# Altium project A3000_16MB.PrjPcb (part 1 of 2)
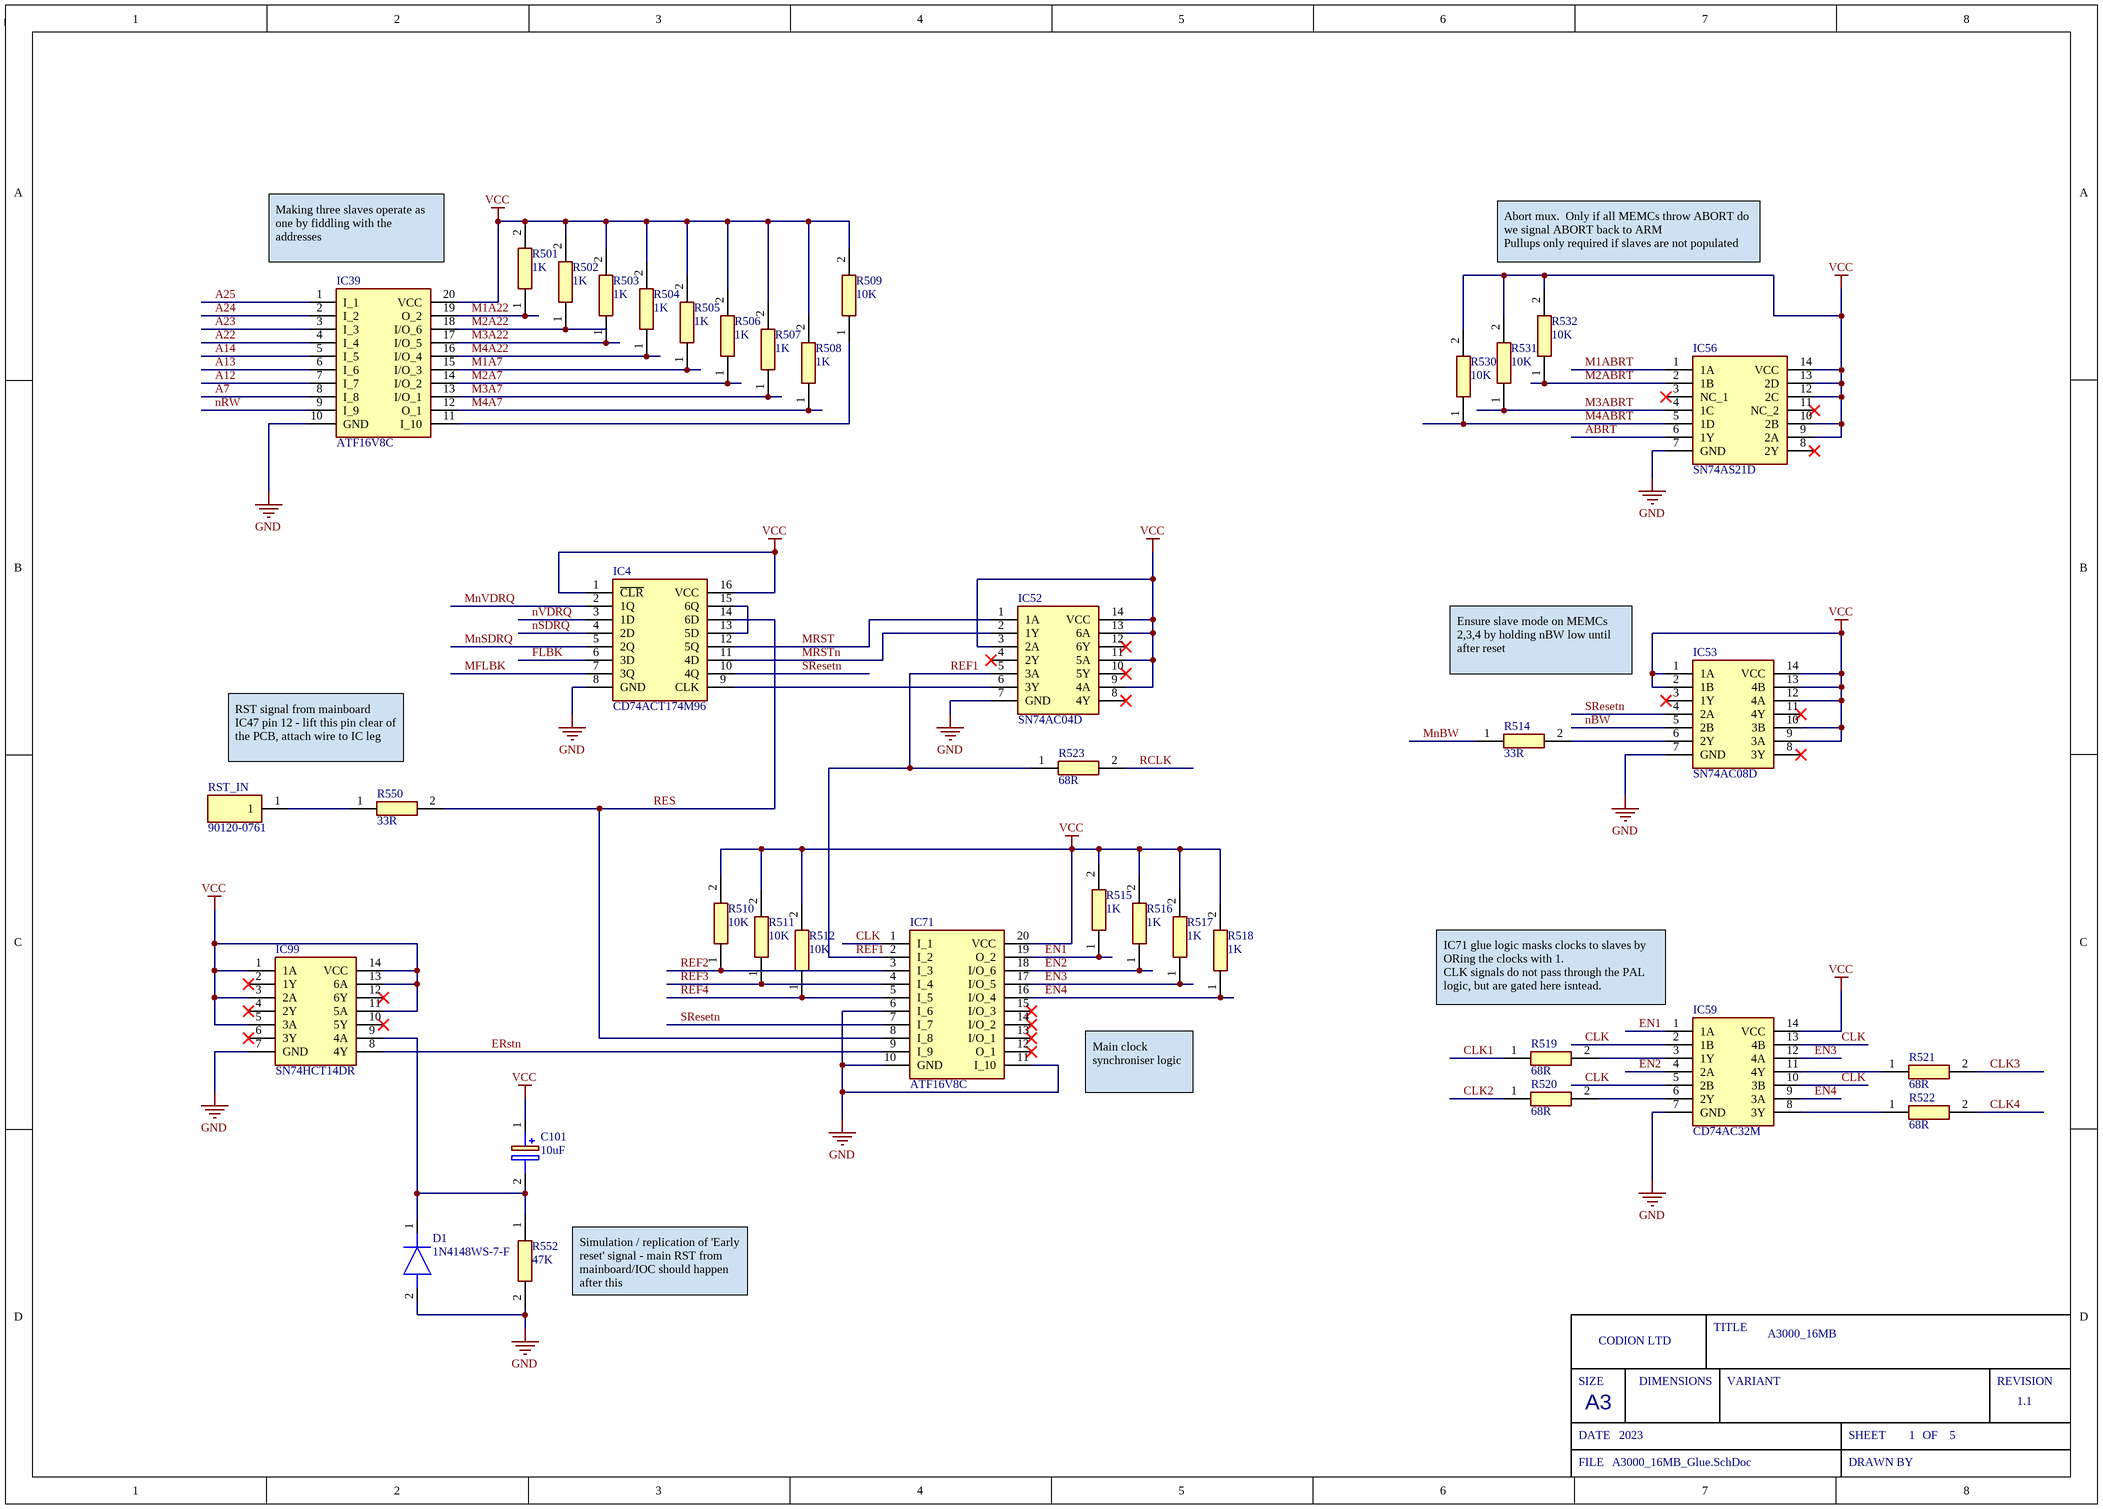
[diagram p0: A3000_16MB_Glue.SchDoc]
BOM_RevNo: 1.1; Engineer_Name: Codion Ltd; PCB_RevNo: 1.1; Project_Title: A3000_16MB; ProjectName: A3000_16MB; Sch_releaseDate: 2023; Sch_RevNo: 1.1
5 sheets, 135 parts. Net scope: global (net labels, ports and power ports of the same name join across sheets).
Board file: A3000_16MB.pcbdoc
Sheets:
  A3000_16MB_Glue.SchDoc
  A3000_16MB.SchDoc
  A3000_16MB_M2.SchDoc
  A3000_16MB_M3.SchDoc
  A3000_16MB_M4.SchDoc

## Sheet A3000_16MB_Glue.SchDoc
size A3; DocumentNumber: 1; SheetNumber: 1; SheetTotal: 5

### Parts
C101  10uF  [EEE0GA101SR]
D1  1N4148WS-7-F  [SOD2513X120N]
IC4  CD74ACT174M96  [SOIC127P600X175-16N]
IC39  ATF16V8C  [DIP762W66P254L2692H508Q20N]
IC52  SN74AC04D  [SOIC127P600X175-14N]
IC53  SN74AC08D  [SOIC127P600X175-14N]
IC56  SN74AS21D  [SOIC127P600X175-14N]
IC59  CD74AC32M  [SOIC127P600X175-14N]
IC71  ATF16V8C  [DIP762W66P254L2692H508Q20N]
IC99  SN74HCT14DR  [SOIC127P600X175-14N]
R501  1K  [RESC1005X40N]
R502  1K  [RESC1005X40N]
R503  1K  [RESC1005X40N]
R504  1K  [RESC1005X40N]
R505  1K  [RESC1005X40N]
R506  1K  [RESC1005X40N]
R507  1K  [RESC1005X40N]
R508  1K  [RESC1005X40N]
R509  10K  [RESC1005X40N]
R510  10K  [RESC1005X40N]
R511  10K  [RESC1005X40N]
R512  10K  [RESC1005X40N]
R514  33R  [RESC1005X40N]
R515  1K  [RESC1005X40N]
R516  1K  [RESC1005X40N]
R517  1K  [RESC1005X40N]
R518  1K  [RESC1005X40N]
R519  68R  [RESC1005X40N]
R520  68R  [RESC1005X40N]
R521  68R  [RESC1005X40N]
R522  68R  [RESC1005X40N]
R523  68R  [RESC1005X40N]
R530  10K  [RESC1005X40N]
R531  10K  [RESC1005X40N]
R532  10K  [RESC1005X40N]
R550  33R  [RESC1005X40N]
R552  47K  [RESC1005X40N]
RST_IN  90120-0761  [HDRV1W90P0X254_1X1_232X249X560P]

### Nets
GND: D1.2(A) IC4.8(GND) IC39.10(GND) IC52.7(GND) IC53.7(GND) IC56.7(GND) IC59.7(GND) IC71.6(I_6) IC71.10(GND) IC71.11(I_10) IC99.7(GND) R552.2
VCC: C101.1(+) IC4.1(~{CLR}) IC4.16(VCC) IC39.20(VCC) IC52.3(2A) IC52.9(4A) IC52.11(5A) IC52.13(6A) IC52.14(VCC) IC53.1(1A) IC53.2(1B) IC53.9(3A) IC53.10(3B) IC53.12(4A) IC53.13(4B) IC53.14(VCC) IC56.9(2A) IC56.10(2B) IC56.12(2C) IC56.13(2D) IC56.14(VCC) IC59.14(VCC) IC71.20(VCC) IC99.1(1A) IC99.3(2A) IC99.5(3A) IC99.11(5A) IC99.13(6A) IC99.14(VCC) R501.2 R502.2 R503.2 R504.2 R505.2 R506.2 R507.2 R508.2 R509.2 R510.2 R511.2 R512.2 R515.2 R516.2 R517.2 R518.2 R530.2 R531.2 R532.2
A7: IC39.8(I_8)
A12: IC39.7(I_7)
A13: IC39.6(I_6)
A14: IC39.5(I_5)
A22: IC39.4(I_4)
A23: IC39.3(I_3)
A24: IC39.2(I_2)
A25: IC39.1(I_1)
ABRT: IC56.6(1Y)
CLK: IC59.2(1B) IC59.5(2B) IC59.10(3B) IC59.13(4B) IC71.1(I_1)
CLK1: R519.1
CLK2: R520.1
CLK3: R521.2
CLK4: R522.2
EN1: IC59.1(1A) IC71.19(O_2) R515.1
EN2: IC59.4(2A) IC71.18(I/O_6) R516.1
EN3: IC59.12(4A) IC71.17(I/O_5) R517.1
EN4: IC59.9(3A) IC71.16(I/O_4) R518.1
ERstn: IC71.9(I_9) IC99.8(4Y)
FLBK: IC4.6(3D)
M1A7: IC39.15(I/O_3) R505.1
M1A22: IC39.19(O_2) R501.1
M1ABRT: IC56.1(1A)
M2A7: IC39.14(I/O_2) R506.1
M2A22: IC39.18(I/O_6) R502.1
M2ABRT: IC56.2(1B) R532.1
M3A7: IC39.13(I/O_1) R507.1
M3A22: IC39.17(I/O_5) R503.1
M3ABRT: IC56.4(1C) R531.1
M4A7: IC39.12(O_1) R508.1
M4A22: IC39.16(I/O_4) R504.1
M4ABRT: IC56.5(1D) R530.1
MFLBK: IC4.7(3Q)
MnBW: R514.1
MnSDRQ: IC4.5(2Q)
MnVDRQ: IC4.2(1Q)
MRST: IC4.12(5Q) IC52.1(1A)
MRSTn: IC4.11(4D) IC52.2(1Y)
nBW: IC53.5(2B)
nRW: IC39.9(I_9)
nSDRQ: IC4.4(2D)
nVDRQ: IC4.3(1D)
RCLK: R523.2
REF1: IC52.5(3A) IC71.2(I_2) R523.1
REF2: IC71.3(I_3) R510.1
REF3: IC71.4(I_4) R511.1
REF4: IC71.5(I_5) R512.1
RES: IC4.14(6D) IC71.8(I_8) R550.2
SResetn: IC4.10(4Q) IC53.4(2A) IC71.7(I_7)
NetC101_2: C101.2(-) D1.1(K) IC99.9(4A) R552.1
NetIC4_9: IC4.9(CLK) IC52.6(3Y)
NetIC4_13: IC4.13(5D) IC4.15(6Q)
NetIC39_11: IC39.11(I_10) R509.1
NetIC53_6: IC53.6(2Y) R514.2
NetIC59_3: IC59.3(1Y) R519.2
NetIC59_6: IC59.6(2Y) R520.2
NetIC59_8: IC59.8(3Y) R522.1
NetIC59_11: IC59.11(4Y) R521.1
NetR550_1: R550.1 RST_IN.1

Not connected (* = marked no-connect by the designer): IC52 4(2Y)* 8(4Y)* 10(5Y)* 12(6Y)*; IC53 3(1Y)* 8(3Y)* 11(4Y)*; IC56 3(NC_1)* 8(2Y)* 11(NC_2)*; IC71 12(O_1)* 13(I/O_1)* 14(I/O_2)* 15(I/O_3)*; IC99 2(1Y)* 4(2Y)* 6(3Y)* 10(5Y)* 12(6Y)*

### Notes on the sheet
- (near IC39) Making three slaves operate as one by fiddling with the addresses
- Abort mux.  Only if all MEMCs throw ABORT do we signal ABORT back to ARM
  Pullups only required if slaves are not populated
- Ensure slave mode on MEMCs 2,3,4 by holding nBW low until after reset
- RST signal from mainboard IC47 pin 12 - lift this pin clear of the PCB, attach wire to IC leg
- IC71 glue logic masks clocks to slaves by ORing the clocks with 1.
  CLK signals do not pass through the PAL logic, but are gated here isntead.
- Main clock synchroniser logic
- Simulation / replication of 'Early reset' signal - main RST from mainboard/IOC should happen after this
- SIZE
- CODION LTD
- DIMENSIONS
- TITLE
- VARIANT
- REVISION
- DATE
- A3
- SHEET
- OF
- FILE
- DRAWN BY

### Library data of the parts
C101 = EEE-1EA100SR: Capacitor Polarised; Manufacturer_Name: Panasonic; Datasheet Link: http://industrial.panasonic.com/cdbs/www-data/pdf/RDE0000/ABA0000C1145.pdf; Height: 6.5mm; Manufacturer_Part_Number: EEE-1EA100SR; Mouser Part Number: 667-EEE-1EA100SR; Mouser Price/Stock: https://www.mouser.co.uk/ProductDetail/Panasonic/EEE-1EA100SR?qs=ANJC8C65Mw4%2Fvo1GoepKcQ%3D%3D; Arrow Part Number: EEE-1EA100SR; Arrow Price/Stock: https://www.arrow.com/en/products/eee-1ea100sr/panasonic?region=nac
D1 = 1N4148WS-7-F: Diode; Manufacturer_Name: Diodes Inc.; Datasheet Link: https://componentsearchengine.com/Datasheets/2/1N4148WS-7-F.pdf; Height: 1.2mm; Manufacturer_Part_Number: 1N4148WS-7-F; Mouser Part Number: 621-1N4148WS-F; Mouser Price/Stock: https://www.mouser.co.uk/ProductDetail/Diodes-Incorporated/1N4148WS-7-F?qs=4drIV0IxA0r8aNy7%2Fu4kVw%3D%3D; Arrow Part Number: 1N4148WS-7-F; Arrow Price/Stock: https://www.arrow.com/en/products/1n4148ws-7-f/diodes-incorporated?region=asia; LCSC Part #: C2128
IC4 = CD74ACT174M96: Integrated Circuit; Manufacturer_Name: Texas Instruments; Datasheet Link: http://www.ti.com/lit/gpn/cd74act174; Height: 1.75mm; Manufacturer_Part_Number: CD74ACT174M96; Mouser Part Number: 595-CD74ACT174M96; Mouser Price/Stock: https://www.mouser.co.uk/ProductDetail/Texas-Instruments/CD74ACT174M96?qs=w32V8uFkMxkDXs1ka6HDkg%3D%3D
IC39 IC71 = PAL16R4AMJ: Integrated Circuit; Manufacturer_Name: Texas Instruments; Datasheet Link: http://www.ti.com/lit/ds/symlink/pal16r4am.pdf; Height: 5.08mm; Manufacturer_Part_Number: PAL16R4AMJ; Mouser Part Number: 595-PAL16R4AMJ; Mouser Price/Stock: https://www.mouser.com/Search/Refine.aspx?Keyword=595-PAL16R4AMJ
IC52 = SN74AC04D: Integrated Circuit; Manufacturer_Name: Texas Instruments; Datasheet Link: http://www.ti.com/lit/ds/symlink/sn74ac04.pdf; Height: 1.75mm; Manufacturer_Part_Number: SN74AC04D; Mouser Part Number: 595-SN74AC04D; Mouser Price/Stock: https://www.mouser.co.uk/ProductDetail/Texas-Instruments/SN74AC04D?qs=w32V8uFkMxkvsyMHHacuZw%3D%3D; Arrow Part Number: SN74AC04D; Arrow Price/Stock: https://www.arrow.com/en/products/sn74ac04d/texas-instruments?region=nac; LCSC Part #: C352940
IC53 = SN74AC08D: Integrated Circuit; Manufacturer_Name: Texas Instruments; Datasheet Link: http://www.ti.com/lit/gpn/sn74ac08; Height: 1.75mm; Manufacturer_Part_Number: SN74AC08D; Mouser Part Number: 595-SN74AC08D; Mouser Price/Stock: https://www.mouser.co.uk/ProductDetail/Texas-Instruments/SN74AC08D?qs=w32V8uFkMxlOh0tslhqkwg%3D%3D; Arrow Part Number: SN74AC08D; Arrow Price/Stock: https://www.arrow.com/en/products/sn74ac08d/texas-instruments; LCSC Part #: C352941
IC56 = SN74AS21D: Integrated Circuit; Manufacturer_Name: Texas Instruments; Datasheet Link: https://www.ti.com/lit/ds/symlink/sn74as21.pdf?HQS=dis-mous-null-mousermode-dsf-pf-null-wwe&ts=1632126162167&ref_url=https%253A%252F%252Fwww.mouser.in%252F; Height: 1.75mm; Manufacturer_Part_Number: SN74AS21D; Mouser Part Number: 595-SN74AS21D; Mouser Price/Stock: https://www.mouser.com/Search/Refine.aspx?Keyword=595-SN74AS21D; Arrow Part Number: SN74AS21D; Arrow Price/Stock: https://www.arrow.com/en/products/sn74as21d/texas-instruments
IC59 = CD74AC32M: Integrated Circuit; Manufacturer_Name: Texas Instruments; Datasheet Link: http://www.ti.com/lit/ds/symlink/cd74ac32.pdf; Height: 1.75mm; Manufacturer_Part_Number: CD74AC32M; Mouser Part Number: 595-CD74AC32M; Mouser Price/Stock: https://www.mouser.co.uk/ProductDetail/Texas-Instruments/CD74AC32M?qs=OorDGPQ79Eqsy7tzrsTtUg%3D%3D; Arrow Part Number: CD74AC32M; Arrow Price/Stock: https://www.arrow.com/en/products/cd74ac32m/texas-instruments; LCSC Part #: C352943
IC99 = SN74HCT14DR: Integrated Circuit; Manufacturer_Name: Texas Instruments; Datasheet Link: http://www.ti.com/lit/ds/symlink/sn74hct14.pdf; Height: 1.75mm; Manufacturer_Part_Number: SN74HCT14DR; Mouser Part Number: 595-SN74HCT14DR; Mouser Price/Stock: https://www.mouser.co.uk/ProductDetail/Texas-Instruments/SN74HCT14DR?qs=SL3LIuy2dWxogEVGE105Iw%3D%3D; Arrow Part Number: SN74HCT14DR; Arrow Price/Stock: https://www.arrow.com/en/products/sn74hct14dr/texas-instruments?region=nac; LCSC Part #: C6769
R501-R508 R515-R518 = CRCW04021K00JNED: Resistor; Manufacturer_Name: Vishay; Datasheet Link: http://www.vishay.com/docs/20035/dcrcwe3.pdf; Height: 0.4mm; Manufacturer_Part_Number: CRCW04021K00JNED; Mouser Part Number: 71-CRCW0402J-1.0K-E3; Mouser Price/Stock: https://www.mouser.co.uk/ProductDetail/Vishay-Dale/CRCW04021K00JNED?qs=YX%252BK5oaHNYpGRsHVuzxl1A%3D%3D; Arrow Part Number: CRCW04021K00JNED; Arrow Price/Stock: https://www.arrow.com/en/products/crcw04021k00jned/vishay; LCSC Part #: C279981
R509-R512 R530-R532 = CRCW040210K0FKEDHP: Resistor; Manufacturer_Name: Vishay; Datasheet Link: http://www.vishay.com/docs/20035/dcrcwe3.pdf; Height: 0.4mm; Manufacturer_Part_Number: CRCW040210K0FKEDHP; Mouser Part Number: 71-CRCW040210K0FKEDH; Mouser Price/Stock: https://www.mouser.co.uk/ProductDetail/Vishay-Dale/CRCW040210K0FKEDHP?qs=FlFvgi4rxBxmIiaeyFjrkA%3D%3D; Arrow Part Number: CRCW040210K0FKEDHP; Arrow Price/Stock: https://www.arrow.com/en/products/crcw040210k0fkedhp/vishay?region=nac; LCSC Part #: C71617
R514 R550 = CRCW040233R0FKED: Resistor; Manufacturer_Name: Vishay; Datasheet Link: http://www.vishay.com/docs/20035/dcrcwe3.pdf; Height: 0.4mm; Manufacturer_Part_Number: CRCW040233R0FKED; Mouser Part Number: 71-CRCW0402-33-E3; Mouser Price/Stock: https://www.mouser.co.uk/ProductDetail/Vishay-Dale/CRCW040233R0FKED?qs=TNtMkGKFKOyo77UGFlXIJw%3D%3D; Arrow Part Number: CRCW040233R0FKED; Arrow Price/Stock: https://www.arrow.com/en/products/crcw040233r0fked/vishay; LCSC Part #: C137880
R519-R523 = CRCW040268R0FKEDHP: Resistor; Manufacturer_Name: Vishay; Datasheet Link: http://www.vishay.com/docs/20035/dcrcwe3.pdf; Height: 0.4mm; Manufacturer_Part_Number: CRCW040268R0FKEDHP; Mouser Part Number: 71-CRCW040268R0FKEDH; Mouser Price/Stock: https://www.mouser.co.uk/ProductDetail/Vishay-Dale/CRCW040268R0FKEDHP?qs=YaA%252B3EhhSt26vU44iyW%252BOw%3D%3D; Arrow Part Number: CRCW040268R0FKEDHP; Arrow Price/Stock: https://www.arrow.com/en/products/crcw040268r0fkedhp/vishay; LCSC Part #: C163455
R552 = CRCW040247K0FKED: Resistor; Manufacturer_Name: Vishay; Datasheet Link: http://www.vishay.com/docs/20035/dcrcwe3.pdf; Height: 0.4mm; Manufacturer_Part_Number: CRCW040247K0FKED; Mouser Part Number: 71-CRCW0402-47K-E3; Mouser Price/Stock: https://www.mouser.co.uk/ProductDetail/Vishay-Dale/CRCW040247K0FKED?qs=rzhQWu8UUS0SPbmGf0DOIg%3D%3D; Arrow Part Number: CRCW040247K0FKED; Arrow Price/Stock: https://www.arrow.com/en/products/crcw040247k0fked/vishay; LCSC Part #: C163440
RST_IN = 90120-0761: Connector; Manufacturer_Name: Molex; Datasheet Link: https://www.molex.com/pdm_docs/sd/901200761_sd.pdf; Height: 5.6mm; Manufacturer_Part_Number: 90120-0761; Mouser Part Number: 538-90120-0761; Mouser Price/Stock: https://www.mouser.co.uk/ProductDetail/Molex/90120-0761?qs=PvP5v7Eimsn%2F58TpDaAAow%3D%3D

## Sheet A3000_16MB.SchDoc: ARM2 to ARM3 Adapter
size A3; DocumentNumber: 1; SheetNumber: 2; SheetTotal: 5
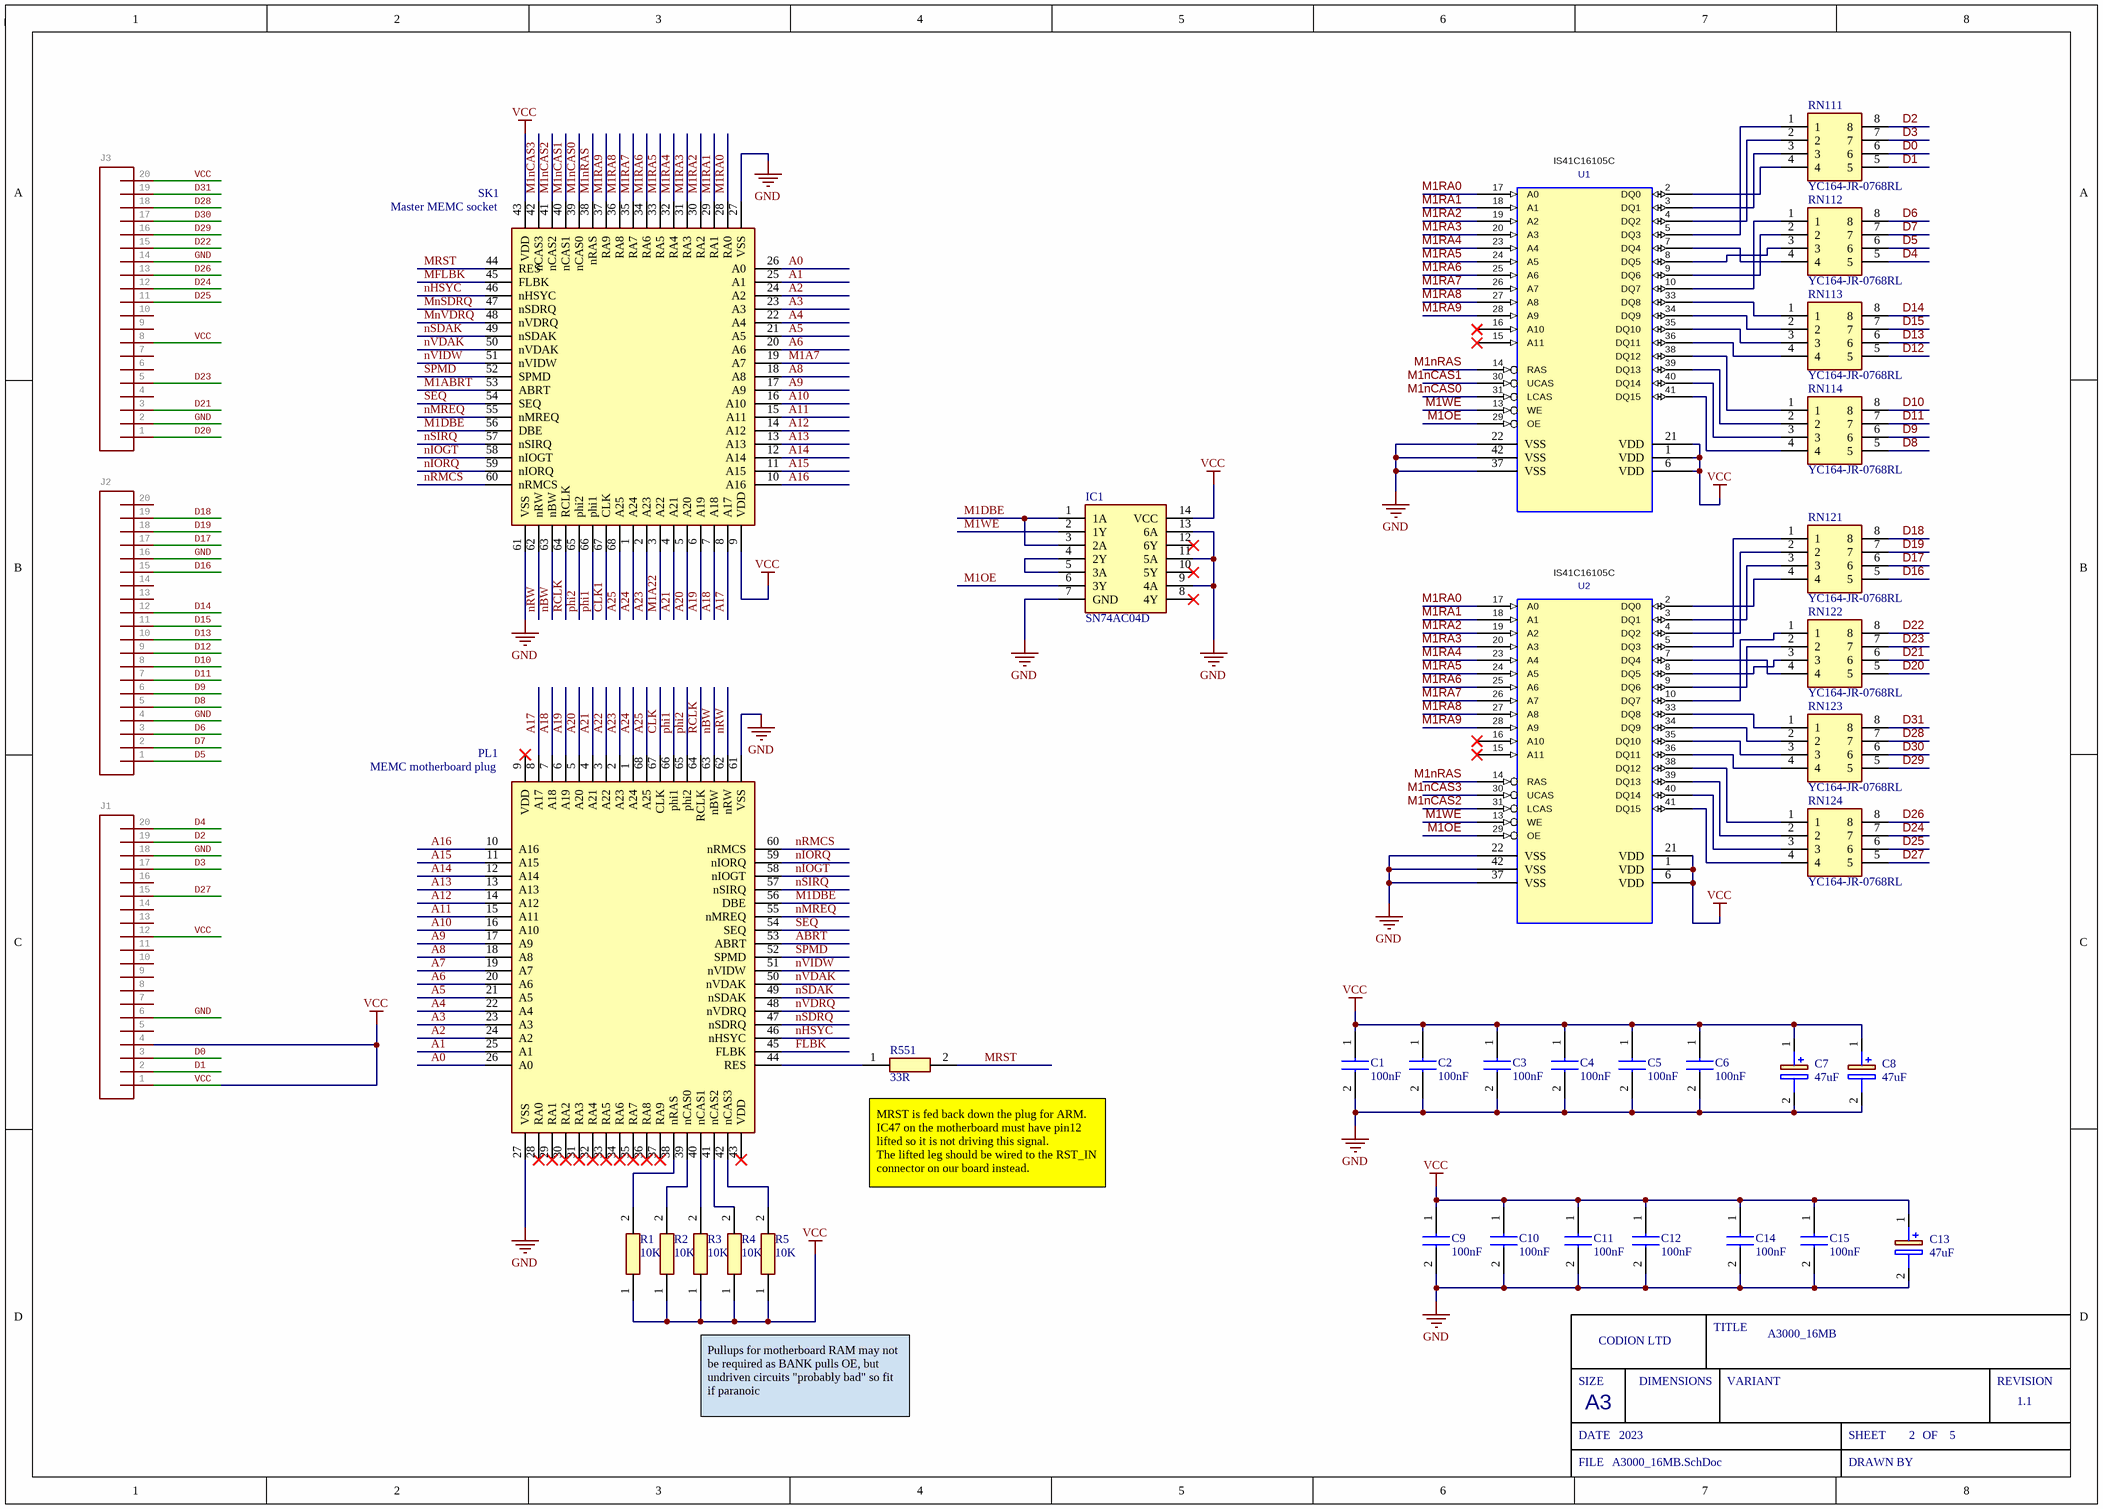
[diagram p1: A3000_16MB.SchDoc]

### Parts
C1  100nF  [CAPC2012X145N]
C2  100nF  [CAPC2012X145N]
C3  100nF  [CAPC2012X145N]
C4  100nF  [CAPC2012X145N]
C5  100nF  [CAPC2012X145N]
C6  100nF  [CAPC2012X145N]
C7  47uF  [EEE1AA101SP]
C8  47uF  [EEE1AA101SP]
C9  100nF  [CAPC2012X145N]
C10  100nF  [CAPC2012X145N]
C11  100nF  [CAPC2012X145N]
C12  100nF  [CAPC2012X145N]
C13  47uF  [EEE1AA101SP]
C14  100nF  [CAPC2012X145N]
C15  100nF  [CAPC2012X145N]
IC1  SN74AC04D  [SOIC127P600X175-14N]
J1  CONN_20  [1X20]  (value not drawn)
J2  CONN_20  [1X20]  (value not drawn)
J3  CONN_20  [1X20]  (value not drawn)
PL1  MEMC motherboard plug  [MEMC_Plug]
R1  10K  [RESC1005X40N]
R2  10K  [RESC1005X40N]
R3  10K  [RESC1005X40N]
R4  10K  [RESC1005X40N]
R5  10K  [RESC1005X40N]
R551  33R  [RESC1005X40N]
RN111  YC164-JR-0768RL  [YC164JR0768RL]
RN112  YC164-JR-0768RL  [YC164JR0768RL]
RN113  YC164-JR-0768RL  [YC164JR0768RL]
RN114  YC164-JR-0768RL  [YC164JR0768RL]
RN121  YC164-JR-0768RL  [YC164JR0768RL]
RN122  YC164-JR-0768RL  [YC164JR0768RL]
RN123  YC164-JR-0768RL  [YC164JR0768RL]
RN124  YC164-JR-0768RL  [YC164JR0768RL]
SK1  Master MEMC socket  [MEMC_Socket]
U1  IS41C16105C  [SOJ-42]
U2  IS41C16105C  [SOJ-42]

### Nets
GND: C1.2 C2.2 C3.2 C4.2 C5.2 C6.2 C7.2(-) C8.2(-) C9.2 C10.2 C11.2 C12.2 C13.2(-) C14.2 C15.2 IC1.7(GND) IC1.9(4A) IC1.11(5A) IC1.13(6A) J1.6 J1.18 J2.4 J2.16 J3.2 J3.14 PL1.27(VSS) PL1.61(VSS) SK1.27(VSS) SK1.61(VSS) U1.22(VSS) U1.37(VSS) U1.42(VSS) U2.22(VSS) U2.37(VSS) U2.42(VSS)
VCC: C1.1 C2.1 C3.1 C4.1 C5.1 C6.1 C7.1(+) C8.1(+) C9.1 C10.1 C11.1 C12.1 C13.1(+) C14.1 C15.1 IC1.14(VCC) J1.1 J1.4 J1.12 J3.8 J3.20 R1.1 R2.1 R3.1 R4.1 R5.1 SK1.9(VDD) SK1.43(VDD) U1.1(VCC) U1.6(VCC) U1.21(VCC) U2.1(VCC) U2.6(VCC) U2.21(VCC)
A0: PL1.26(A0) SK1.26(A0)
A1: PL1.25(A1) SK1.25(A1)
A2: PL1.24(A2) SK1.24(A2)
A3: PL1.23(A3) SK1.23(A3)
A4: PL1.22(A4) SK1.22(A4)
A5: PL1.21(A5) SK1.21(A5)
A6: PL1.20(A6) SK1.20(A6)
A7: PL1.19(A7)
A8: PL1.18(A8) SK1.18(A8)
A9: PL1.17(A9) SK1.17(A9)
A10: PL1.16(A10) SK1.16(A10)
A11: PL1.15(A11) SK1.15(A11)
A12: PL1.14(A12) SK1.14(A12)
A13: PL1.13(A13) SK1.13(A13)
A14: PL1.12(A14) SK1.12(A14)
A15: PL1.11(A15) SK1.11(A15)
A16: PL1.10(A16) SK1.10(A16)
A17: PL1.8(A17) SK1.8(A17)
A18: PL1.7(A18) SK1.7(A18)
A19: PL1.6(A19) SK1.6(A19)
A20: PL1.5(A20) SK1.5(A20)
A21: PL1.4(A21) SK1.4(A21)
A22: PL1.3(A22)
A23: PL1.2(A23) SK1.2(A23)
A24: PL1.1(A24) SK1.1(A24)
A25: PL1.68(A25) SK1.68(A25)
ABRT: PL1.53(ABRT)
CLK: PL1.67(CLK)
CLK1: SK1.67(CLK)
D0: J1.3 RN111.6
D1: J1.2 RN111.5
D2: J1.19 RN111.8
D3: J1.17 RN111.7
D4: J1.20 RN112.5
D5: J2.1 RN112.6
D6: J2.3 RN112.8
D7: J2.2 RN112.7
D8: J2.5 RN114.5
D9: J2.6 RN114.6
D10: J2.8 RN114.8
D11: J2.7 RN114.7
D12: J2.9 RN113.5
D13: J2.10 RN113.6
D14: J2.12 RN113.8
D15: J2.11 RN113.7
D16: J2.15 RN121.5
D17: J2.17 RN121.6
D18: J2.19 RN121.8
D19: J2.18 RN121.7
D20: J3.1 RN122.5
D21: J3.3 RN122.6
D22: J3.15 RN122.8
D23: J3.5 RN122.7
D24: J3.12 RN124.7
D25: J3.11 RN124.6
D26: J3.13 RN124.8
D27: J1.15 RN124.5
D28: J3.18 RN123.7
D29: J3.16 RN123.5
D30: J3.17 RN123.6
D31: J3.19 RN123.8
FLBK: PL1.45(FLBK)
M1A7: SK1.19(A7)
M1A22: SK1.3(A22)
M1ABRT: SK1.53(ABRT)
M1DBE: IC1.1(1A) IC1.3(2A) PL1.56(DBE) SK1.56(DBE)
M1nCAS0: SK1.39(nCAS0) U1.31(LCAS)
M1nCAS1: SK1.40(nCAS1) U1.30(UCAS)
M1nCAS2: SK1.41(nCAS2) U2.31(LCAS)
M1nCAS3: SK1.42(nCAS3) U2.30(UCAS)
M1nRAS: SK1.38(nRAS) U1.14(RAS) U2.14(RAS)
M1OE: IC1.6(3Y) U1.29(OE) U2.29(OE)
M1RA0: SK1.28(RA0) U1.17(A0) U2.17(A0)
M1RA1: SK1.29(RA1) U1.18(A1) U2.18(A1)
M1RA2: SK1.30(RA2) U1.19(A2) U2.19(A2)
M1RA3: SK1.31(RA3) U1.20(A3) U2.20(A3)
M1RA4: SK1.32(RA4) U1.23(A4) U2.23(A4)
M1RA5: SK1.33(RA5) U1.24(A5) U2.24(A5)
M1RA6: SK1.34(RA6) U1.25(A6) U2.25(A6)
M1RA7: SK1.35(RA7) U1.26(A7) U2.26(A7)
M1RA8: SK1.36(RA8) U1.27(A8) U2.27(A8)
M1RA9: SK1.37(RA9) U1.28(A9) U2.28(A9)
M1WE: IC1.2(1Y) U1.13(WE) U2.13(WE)
MFLBK: SK1.45(FLBK)
MnSDRQ: SK1.47(nSDRQ)
MnVDRQ: SK1.48(nVDRQ)
MRST: R551.2 SK1.44(RES)
nBW: PL1.63(nBW) SK1.63(nBW)
nHSYC: PL1.46(nHSYC) SK1.46(nHSYC)
nIOGT: PL1.58(nIOGT) SK1.58(nIOGT)
nIORQ: PL1.59(nIORQ) SK1.59(nIORQ)
nMREQ: PL1.55(nMREQ) SK1.55(nMREQ)
nRMCS: PL1.60(nRMCS) SK1.60(nRMCS)
nRW: PL1.62(nRW) SK1.62(nRW)
nSDAK: PL1.49(nSDAK) SK1.49(nSDAK)
nSDRQ: PL1.47(nSDRQ)
nSIRQ: PL1.57(nSIRQ) SK1.57(nSIRQ)
nVDAK: PL1.50(nVDAK) SK1.50(nVDAK)
nVDRQ: PL1.48(nVDRQ)
nVIDW: PL1.51(nVIDW) SK1.51(nVIDW)
phi1: PL1.66(phi1) SK1.66(phi1)
phi2: PL1.65(phi2) SK1.65(phi2)
RCLK: PL1.64(RCLK) SK1.64(RCLK)
SEQ: PL1.54(SEQ) SK1.54(SEQ)
SPMD: PL1.52(SPMD) SK1.52(SPMD)
NetIC1_4: IC1.4(2Y) IC1.5(3A)
NetPL1_38: PL1.38(nRAS) R1.2
NetPL1_39: PL1.39(nCAS0) R2.2
NetPL1_40: PL1.40(nCAS1) R3.2
NetPL1_41: PL1.41(nCAS2) R4.2
NetPL1_42: PL1.42(nCAS3) R5.2
NetPL1_44: PL1.44(RES) R551.1
NetRN111_1: RN111.1 U1.5(DQ3)
NetRN111_2: RN111.2 U1.4(DQ2)
NetRN111_3: RN111.3 U1.3(DQ1)
NetRN111_4: RN111.4 U1.2(DQ0)
NetRN112_1: RN112.1 U1.10(DQ7)
NetRN112_2: RN112.2 U1.9(DQ6)
NetRN112_3: RN112.3 U1.8(DQ5)
NetRN112_4: RN112.4 U1.7(DQ4)
NetRN113_1: RN113.1 U1.33(DQ8)
NetRN113_2: RN113.2 U1.34(DQ9)
NetRN113_3: RN113.3 U1.35(DQ10)
NetRN113_4: RN113.4 U1.36(DQ11)
NetRN114_1: RN114.1 U1.38(DQ12)
NetRN114_2: RN114.2 U1.39(DQ13)
NetRN114_3: RN114.3 U1.40(DQ14)
NetRN114_4: RN114.4 U1.41(DQ15)
NetRN121_1: RN121.1 U2.5(DQ3)
NetRN121_2: RN121.2 U2.4(DQ2)
NetRN121_3: RN121.3 U2.3(DQ1)
NetRN121_4: RN121.4 U2.2(DQ0)
NetRN122_1: RN122.1 U2.10(DQ7)
NetRN122_2: RN122.2 U2.9(DQ6)
NetRN122_3: RN122.3 U2.8(DQ5)
NetRN122_4: RN122.4 U2.7(DQ4)
NetRN123_1: RN123.1 U2.33(DQ8)
NetRN123_2: RN123.2 U2.34(DQ9)
NetRN123_3: RN123.3 U2.35(DQ10)
NetRN123_4: RN123.4 U2.36(DQ11)
NetRN124_1: RN124.1 U2.38(DQ12)
NetRN124_2: RN124.2 U2.39(DQ13)
NetRN124_3: RN124.3 U2.40(DQ14)
NetRN124_4: RN124.4 U2.41(DQ15)

Not connected (* = marked no-connect by the designer): IC1 8(4Y)* 10(5Y)* 12(6Y)*; J1 5 7 8 9 10 11 13 14 16; J2 13 14 20; J3 4 6 7 9 10; PL1 9(VDD)* 28(RA0)* 29(RA1)* 30(RA2)* 31(RA3)* 32(RA4)* 33(RA5)* 34(RA6)* 35(RA7)* 36(RA8)* 37(RA9)* 43(VDD)*; U1 15(A11)* 16(A10)*; U2 15(A11)* 16(A10)*

### Notes on the sheet
- (near R551) MRST is fed back down the plug for ARM.
  IC47 on the motherboard must have pin12 lifted so it is not driving this signal.
  The lifted leg should be wired to the RST_IN connector on our board instead.
- Pullups for motherboard RAM may not be required as BANK pulls OE, but undriven circuits "probably bad" so fit if paranoic
- SIZE
- CODION LTD
- DIMENSIONS
- TITLE
- VARIANT
- REVISION
- DATE
- A3
- SHEET
- OF
- FILE
- DRAWN BY

### Library data of the parts
C1-C6 C9-C12 C14 C15 = C2012X7R1H104K125AM: Capacitor; Manufacturer_Name: TDK; Datasheet Link: https://product.tdk.com/info/en/catalog/datasheets/mlcc_commercial_midvoltage_en.pdf; Height: 1.45mm; Manufacturer_Part_Number: C2012X7R1H104K125AM; Mouser Part Number: 810-C2012X7R1H104KT5; Mouser Price/Stock: https://www.mouser.com/Search/Refine.aspx?Keyword=810-C2012X7R1H104KT5; Arrow Part Number: C2012X7R1H104K125AM; Arrow Price/Stock: https://www.arrow.com/en/products/c2012x7r1h104k125am/tdk; LCSC Part #: C111492
C7 C8 C13 = EEE1VA470WP: Capacitor Polarised; Manufacturer_Name: Panasonic; Datasheet Link: http://industrial.panasonic.com/cdbs/www-data/pdf/RDE0000/ABA0000C1145.pdf; Height: 7.8mm; Manufacturer_Part_Number: EEE1VA470WP
IC1 = SN74AC04D: as IC52 on sheet A3000_16MB_Glue; Datasheet Link: http://www.ti.com/lit/ds/symlink/sn74ac04.pdf; Height: 1.75mm; Manufacturer_Part_Number: SN74AC04D; Mouser Part Number: 595-SN74AC04D; Mouser Price/Stock: https://www.mouser.co.uk/ProductDetail/Texas-Instruments/SN74AC04D?qs=w32V8uFkMxkvsyMHHacuZw%3D%3D; Arrow Part Number: SN74AC04D; Arrow Price/Stock: https://www.arrow.com/en/products/sn74ac04d/texas-instruments?region=nac; LCSC Part #: C352940
J1-J3 = CONN_20: GateName_1: G$1; SymbolName_1: CONN_20; LibraryName: SparkFun-Connectors; DeviceSetName: CONN_20
PL1 = MEMC_Plug: MEMC plug
R1-R5 = CRCW040210K0FKEDHP: Resistor; Manufacturer_Name: Vishay; Datasheet Link: http://www.vishay.com/docs/20035/dcrcwe3.pdf; Height: 0.4mm; Manufacturer_Part_Number: CRCW040210K0FKEDHP; Mouser Part Number: 71-CRCW040210K0FKEDH; Mouser Price/Stock: https://www.mouser.co.uk/ProductDetail/Vishay-Dale/CRCW040210K0FKEDHP?qs=FlFvgi4rxBxmIiaeyFjrkA%3D%3D; Arrow Part Number: CRCW040210K0FKEDHP; Arrow Price/Stock: https://www.arrow.com/en/products/crcw040210k0fkedhp/vishay?region=nac; LCSC Part #: C71617
R551 = CRCW040233R0FKED: Resistor; Manufacturer_Name: Vishay; Datasheet Link: http://www.vishay.com/docs/20035/dcrcwe3.pdf; Height: 0.4mm; Manufacturer_Part_Number: CRCW040233R0FKED; Mouser Part Number: 71-CRCW0402-33-E3; Mouser Price/Stock: https://www.mouser.co.uk/ProductDetail/Vishay-Dale/CRCW040233R0FKED?qs=TNtMkGKFKOyo77UGFlXIJw%3D%3D; Arrow Part Number: CRCW040233R0FKED; Arrow Price/Stock: https://www.arrow.com/en/products/crcw040233r0fked/vishay; LCSC Part #: C137880
RN111-RN114 RN121-RN124 = YC164-JR-0768RL: Resistor Network; Manufacturer_Name: KEMET; Datasheet Link: https://www.yageo.com/upload/media/product/productsearch/datasheet/rchip/PYu-YC_TC_group_51_RoHS_L_9.pdf; Height: 0.7mm; Manufacturer_Part_Number: YC164-JR-0768RL; Mouser Part Number: 603-YC164-JR-0768RL; Mouser Price/Stock: https://www.mouser.co.uk/ProductDetail/Yageo/YC164-JR-0768RL?qs=8cPjvKtxWv7AOp%2F0jDxI3w%3D%3D; Arrow Part Number: YC164-JR-0768RL; Arrow Price/Stock: https://www.arrow.com/en/products/yc164-jr-0768rl/yageo; LCSC Part #: C695188
SK1 = MEMC_Skt: MEMC socket; Manufacturer_Name: 3M; Manufacturer_Part_Number: 8468-21B1-RK-TR; Datasheet Link: https://www.arrow.com/en/products/8468-21b1-rk-tr/3m; Height: 4.6mm; Mouser Part Number: 517-8468-21B1-RK-TR; Mouser Price/Stock: https://www.mouser.co.uk/ProductDetail/3M-Electronic-Solutions-Division/8468-21B1-RK-TR?qs=X%2F%2F06fXhnJ18zOj3KK47CQ%3D%3D; Arrow Part Number: 8468-21B1-RK-TR; Arrow Price/Stock: https://www.arrow.com/en/products/8468-21b1-rk-tr/3m
U1 U2 = DRAM_1MX16_SOJ: Value: IS41C16105C

## Sheet A3000_16MB_M2.SchDoc: ARM2 to ARM3 Adapter
size A3; DocumentNumber: 1; SheetNumber: 3; SheetTotal: 5
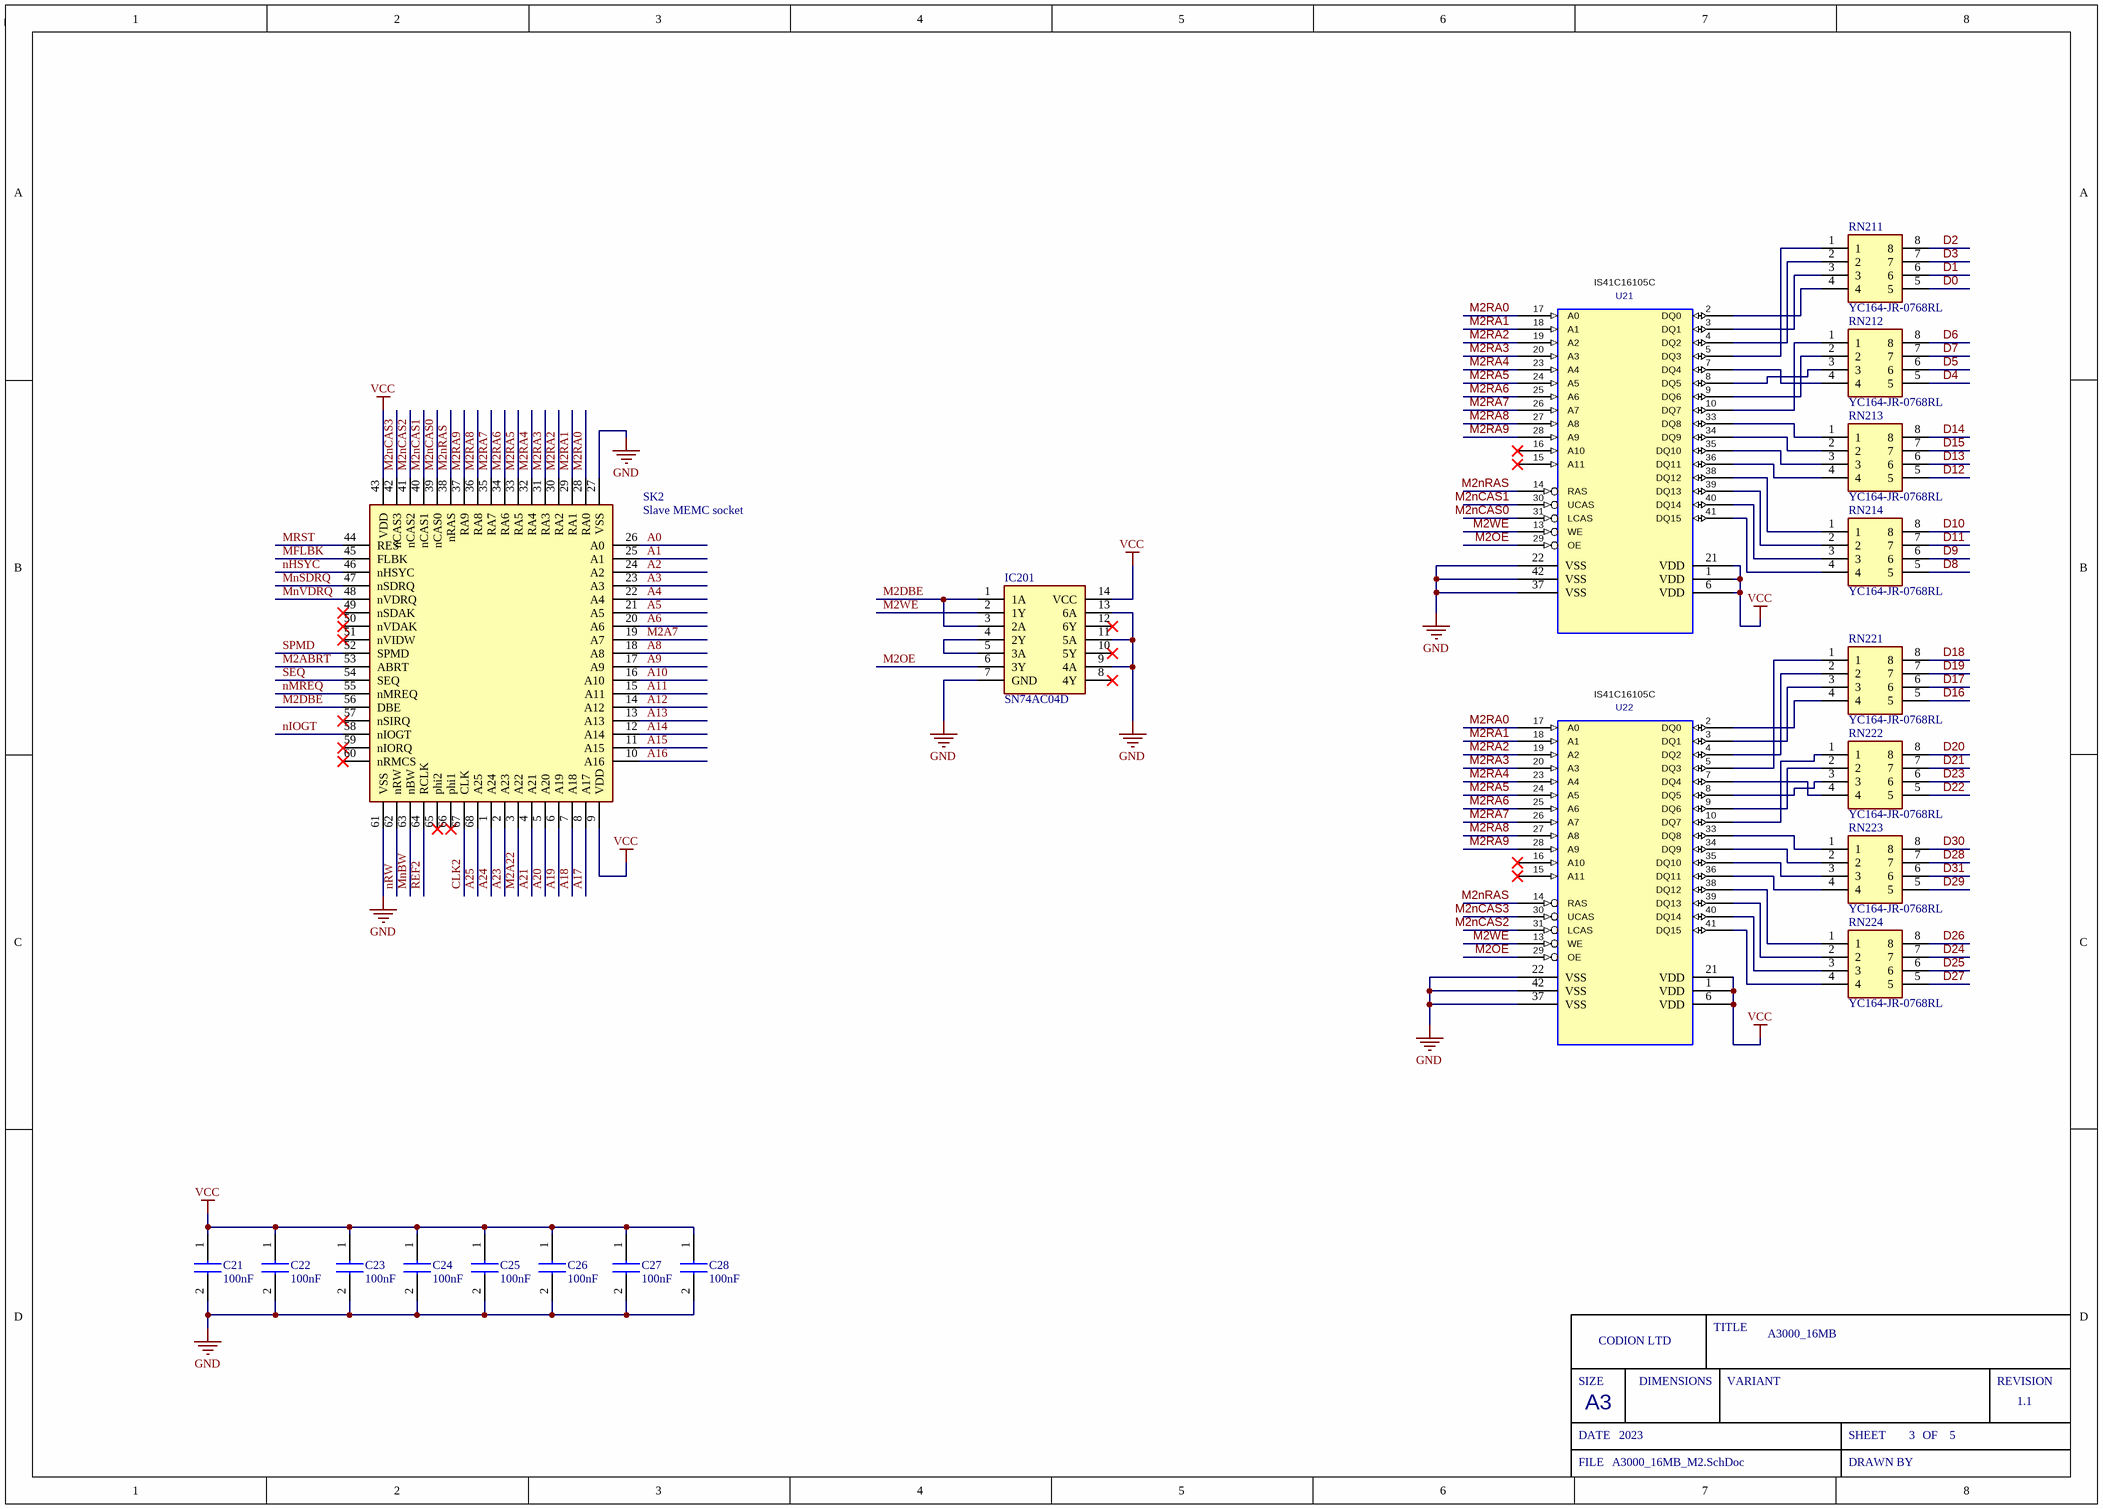
[diagram p2: A3000_16MB_M2.SchDoc]

### Parts
C21  100nF  [CAPC2012X145N]
C22  100nF  [CAPC2012X145N]
C23  100nF  [CAPC2012X145N]
C24  100nF  [CAPC2012X145N]
C25  100nF  [CAPC2012X145N]
C26  100nF  [CAPC2012X145N]
C27  100nF  [CAPC2012X145N]
C28  100nF  [CAPC2012X145N]
IC201  SN74AC04D  [SOIC127P600X175-14N]
RN211  YC164-JR-0768RL  [YC164JR0768RL]
RN212  YC164-JR-0768RL  [YC164JR0768RL]
RN213  YC164-JR-0768RL  [YC164JR0768RL]
RN214  YC164-JR-0768RL  [YC164JR0768RL]
RN221  YC164-JR-0768RL  [YC164JR0768RL]
RN222  YC164-JR-0768RL  [YC164JR0768RL]
RN223  YC164-JR-0768RL  [YC164JR0768RL]
RN224  YC164-JR-0768RL  [YC164JR0768RL]
SK2  Slave MEMC socket  [MEMC_Socket]
U21  IS41C16105C  [SOJ-42]
U22  IS41C16105C  [SOJ-42]

### Nets
GND: C21.2 C22.2 C23.2 C24.2 C25.2 C26.2 C27.2 C28.2 IC201.7(GND) IC201.9(4A) IC201.11(5A) IC201.13(6A) SK2.27(VSS) SK2.61(VSS) U21.22(VSS) U21.37(VSS) U21.42(VSS) U22.22(VSS) U22.37(VSS) U22.42(VSS)
VCC: C21.1 C22.1 C23.1 C24.1 C25.1 C26.1 C27.1 C28.1 IC201.14(VCC) SK2.9(VDD) SK2.43(VDD) U21.1(VCC) U21.6(VCC) U21.21(VCC) U22.1(VCC) U22.6(VCC) U22.21(VCC)
A0: SK2.26(A0)
A1: SK2.25(A1)
A2: SK2.24(A2)
A3: SK2.23(A3)
A4: SK2.22(A4)
A5: SK2.21(A5)
A6: SK2.20(A6)
A8: SK2.18(A8)
A9: SK2.17(A9)
A10: SK2.16(A10)
A11: SK2.15(A11)
A12: SK2.14(A12)
A13: SK2.13(A13)
A14: SK2.12(A14)
A15: SK2.11(A15)
A16: SK2.10(A16)
A17: SK2.8(A17)
A18: SK2.7(A18)
A19: SK2.6(A19)
A20: SK2.5(A20)
A21: SK2.4(A21)
A23: SK2.2(A23)
A24: SK2.1(A24)
A25: SK2.68(A25)
CLK2: SK2.67(CLK)
D0: RN211.5
D1: RN211.6
D2: RN211.8
D3: RN211.7
D4: RN212.5
D5: RN212.6
D6: RN212.8
D7: RN212.7
D8: RN214.5
D9: RN214.6
D10: RN214.8
D11: RN214.7
D12: RN213.5
D13: RN213.6
D14: RN213.8
D15: RN213.7
D16: RN221.5
D17: RN221.6
D18: RN221.8
D19: RN221.7
D20: RN222.8
D21: RN222.7
D22: RN222.5
D23: RN222.6
D24: RN224.7
D25: RN224.6
D26: RN224.8
D27: RN224.5
D28: RN223.7
D29: RN223.5
D30: RN223.8
D31: RN223.6
M2A7: SK2.19(A7)
M2A22: SK2.3(A22)
M2ABRT: SK2.53(ABRT)
M2DBE: IC201.1(1A) IC201.3(2A) SK2.56(DBE)
M2nCAS0: SK2.39(nCAS0) U21.31(LCAS)
M2nCAS1: SK2.40(nCAS1) U21.30(UCAS)
M2nCAS2: SK2.41(nCAS2) U22.31(LCAS)
M2nCAS3: SK2.42(nCAS3) U22.30(UCAS)
M2nRAS: SK2.38(nRAS) U21.14(RAS) U22.14(RAS)
M2OE: IC201.6(3Y) U21.29(OE) U22.29(OE)
M2RA0: SK2.28(RA0) U21.17(A0) U22.17(A0)
M2RA1: SK2.29(RA1) U21.18(A1) U22.18(A1)
M2RA2: SK2.30(RA2) U21.19(A2) U22.19(A2)
M2RA3: SK2.31(RA3) U21.20(A3) U22.20(A3)
M2RA4: SK2.32(RA4) U21.23(A4) U22.23(A4)
M2RA5: SK2.33(RA5) U21.24(A5) U22.24(A5)
M2RA6: SK2.34(RA6) U21.25(A6) U22.25(A6)
M2RA7: SK2.35(RA7) U21.26(A7) U22.26(A7)
M2RA8: SK2.36(RA8) U21.27(A8) U22.27(A8)
M2RA9: SK2.37(RA9) U21.28(A9) U22.28(A9)
M2WE: IC201.2(1Y) U21.13(WE) U22.13(WE)
MFLBK: SK2.45(FLBK)
MnBW: SK2.63(nBW)
MnSDRQ: SK2.47(nSDRQ)
MnVDRQ: SK2.48(nVDRQ)
MRST: SK2.44(RES)
nHSYC: SK2.46(nHSYC)
nIOGT: SK2.58(nIOGT)
nMREQ: SK2.55(nMREQ)
nRW: SK2.62(nRW)
REF2: SK2.64(RCLK)
SEQ: SK2.54(SEQ)
SPMD: SK2.52(SPMD)
NetIC201_4: IC201.4(2Y) IC201.5(3A)
NetRN211_1: RN211.1 U21.5(DQ3)
NetRN211_2: RN211.2 U21.4(DQ2)
NetRN211_3: RN211.3 U21.3(DQ1)
NetRN211_4: RN211.4 U21.2(DQ0)
NetRN212_1: RN212.1 U21.10(DQ7)
NetRN212_2: RN212.2 U21.9(DQ6)
NetRN212_3: RN212.3 U21.8(DQ5)
NetRN212_4: RN212.4 U21.7(DQ4)
NetRN213_1: RN213.1 U21.33(DQ8)
NetRN213_2: RN213.2 U21.34(DQ9)
NetRN213_3: RN213.3 U21.35(DQ10)
NetRN213_4: RN213.4 U21.36(DQ11)
NetRN214_1: RN214.1 U21.38(DQ12)
NetRN214_2: RN214.2 U21.39(DQ13)
NetRN214_3: RN214.3 U21.40(DQ14)
NetRN214_4: RN214.4 U21.41(DQ15)
NetRN221_1: RN221.1 U22.5(DQ3)
NetRN221_2: RN221.2 U22.4(DQ2)
NetRN221_3: RN221.3 U22.3(DQ1)
NetRN221_4: RN221.4 U22.2(DQ0)
NetRN222_1: RN222.1 U22.10(DQ7)
NetRN222_2: RN222.2 U22.9(DQ6)
NetRN222_3: RN222.3 U22.8(DQ5)
NetRN222_4: RN222.4 U22.7(DQ4)
NetRN223_1: RN223.1 U22.33(DQ8)
NetRN223_2: RN223.2 U22.34(DQ9)
NetRN223_3: RN223.3 U22.35(DQ10)
NetRN223_4: RN223.4 U22.36(DQ11)
NetRN224_1: RN224.1 U22.38(DQ12)
NetRN224_2: RN224.2 U22.39(DQ13)
NetRN224_3: RN224.3 U22.40(DQ14)
NetRN224_4: RN224.4 U22.41(DQ15)

Not connected (* = marked no-connect by the designer): IC201 8(4Y)* 10(5Y)* 12(6Y)*; SK2 49(nSDAK)* 50(nVDAK)* 51(nVIDW)* 57(nSIRQ)* 59(nIORQ)* 60(nRMCS)* 65(phi2)* 66(phi1)*; U21 15(A11)* 16(A10)*; U22 15(A11)* 16(A10)*

### Notes on the sheet
- SIZE
- CODION LTD
- DIMENSIONS
- TITLE
- VARIANT
- REVISION
- DATE
- A3
- SHEET
- OF
- FILE
- DRAWN BY

### Library data of the parts
C21-C28 = C2012X7R1H104K125AM: Capacitor; Manufacturer_Name: TDK; Datasheet Link: https://product.tdk.com/info/en/catalog/datasheets/mlcc_commercial_midvoltage_en.pdf; Height: 1.45mm; Manufacturer_Part_Number: C2012X7R1H104K125AM; Mouser Part Number: 810-C2012X7R1H104KT5; Mouser Price/Stock: https://www.mouser.com/Search/Refine.aspx?Keyword=810-C2012X7R1H104KT5; Arrow Part Number: C2012X7R1H104K125AM; Arrow Price/Stock: https://www.arrow.com/en/products/c2012x7r1h104k125am/tdk; LCSC Part #: C111492
IC201 = SN74AC04D: as IC52 on sheet A3000_16MB_Glue; Datasheet Link: http://www.ti.com/lit/ds/symlink/sn74ac04.pdf; Height: 1.75mm; Manufacturer_Part_Number: SN74AC04D; Mouser Part Number: 595-SN74AC04D; Mouser Price/Stock: https://www.mouser.co.uk/ProductDetail/Texas-Instruments/SN74AC04D?qs=w32V8uFkMxkvsyMHHacuZw%3D%3D; Arrow Part Number: SN74AC04D; Arrow Price/Stock: https://www.arrow.com/en/products/sn74ac04d/texas-instruments?region=nac; LCSC Part #: C352940
RN211-RN214 RN221-RN224 = YC164-JR-0768RL: as RN111 on sheet A3000_16MB; Datasheet Link: https://www.yageo.com/upload/media/product/productsearch/datasheet/rchip/PYu-YC_TC_group_51_RoHS_L_9.pdf; Height: 0.7mm; Manufacturer_Part_Number: YC164-JR-0768RL; Mouser Part Number: 603-YC164-JR-0768RL; Mouser Price/Stock: https://www.mouser.co.uk/ProductDetail/Yageo/YC164-JR-0768RL?qs=8cPjvKtxWv7AOp%2F0jDxI3w%3D%3D; Arrow Part Number: YC164-JR-0768RL; Arrow Price/Stock: https://www.arrow.com/en/products/yc164-jr-0768rl/yageo; LCSC Part #: C695188
SK2 = MEMC_Skt: as SK1 on sheet A3000_16MB; Datasheet Link: https://www.arrow.com/en/products/8468-21b1-rk-tr/3m; Height: 4.6mm; Mouser Part Number: 517-8468-21B1-RK-TR; Mouser Price/Stock: https://www.mouser.co.uk/ProductDetail/3M-Electronic-Solutions-Division/8468-21B1-RK-TR?qs=X%2F%2F06fXhnJ18zOj3KK47CQ%3D%3D; Arrow Part Number: 8468-21B1-RK-TR; Arrow Price/Stock: https://www.arrow.com/en/products/8468-21b1-rk-tr/3m
U21 U22 = DRAM_1MX16_SOJ: Value: IS41C16105C

## Sheet A3000_16MB_M3.SchDoc: ARM2 to ARM3 Adapter
size A3; DocumentNumber: 1; SheetNumber: 4; SheetTotal: 5
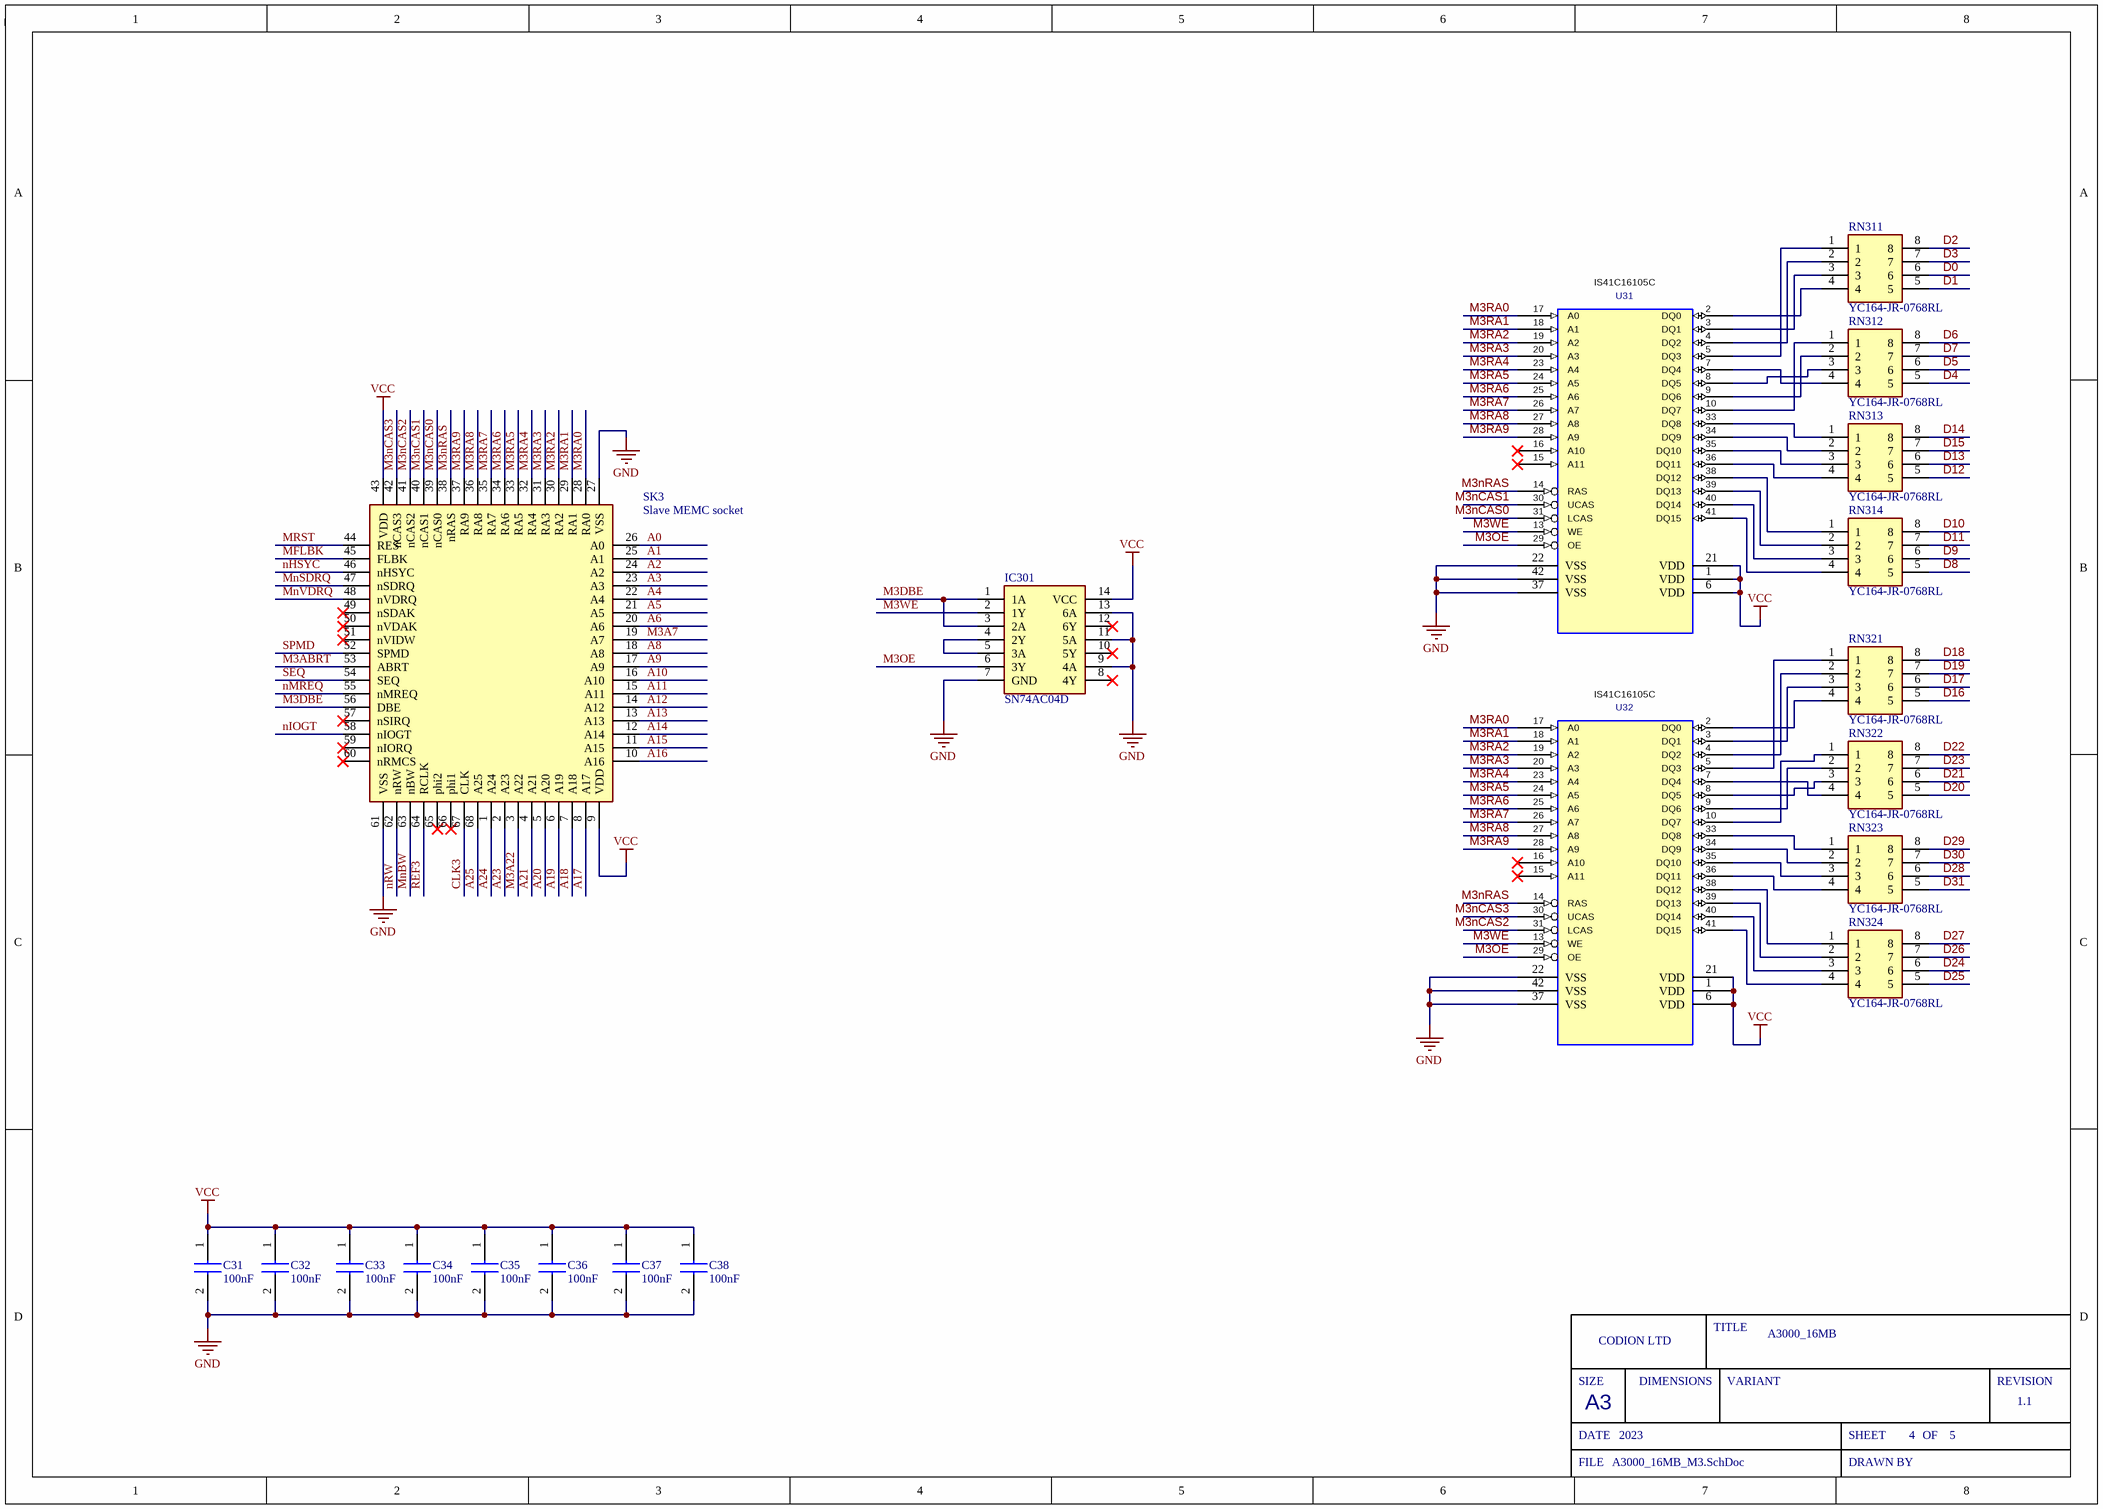
[diagram p3: A3000_16MB_M3.SchDoc]

### Parts
C31  100nF  [CAPC2012X145N]
C32  100nF  [CAPC2012X145N]
C33  100nF  [CAPC2012X145N]
C34  100nF  [CAPC2012X145N]
C35  100nF  [CAPC2012X145N]
C36  100nF  [CAPC2012X145N]
C37  100nF  [CAPC2012X145N]
C38  100nF  [CAPC2012X145N]
IC301  SN74AC04D  [SOIC127P600X175-14N]
RN311  YC164-JR-0768RL  [YC164JR0768RL]
RN312  YC164-JR-0768RL  [YC164JR0768RL]
RN313  YC164-JR-0768RL  [YC164JR0768RL]
RN314  YC164-JR-0768RL  [YC164JR0768RL]
RN321  YC164-JR-0768RL  [YC164JR0768RL]
RN322  YC164-JR-0768RL  [YC164JR0768RL]
RN323  YC164-JR-0768RL  [YC164JR0768RL]
RN324  YC164-JR-0768RL  [YC164JR0768RL]
SK3  Slave MEMC socket  [MEMC_Socket]
U31  IS41C16105C  [SOJ-42]
U32  IS41C16105C  [SOJ-42]

### Nets
GND: C31.2 C32.2 C33.2 C34.2 C35.2 C36.2 C37.2 C38.2 IC301.7(GND) IC301.9(4A) IC301.11(5A) IC301.13(6A) SK3.27(VSS) SK3.61(VSS) U31.22(VSS) U31.37(VSS) U31.42(VSS) U32.22(VSS) U32.37(VSS) U32.42(VSS)
VCC: C31.1 C32.1 C33.1 C34.1 C35.1 C36.1 C37.1 C38.1 IC301.14(VCC) SK3.9(VDD) SK3.43(VDD) U31.1(VCC) U31.6(VCC) U31.21(VCC) U32.1(VCC) U32.6(VCC) U32.21(VCC)
A0: SK3.26(A0)
A1: SK3.25(A1)
A2: SK3.24(A2)
A3: SK3.23(A3)
A4: SK3.22(A4)
A5: SK3.21(A5)
A6: SK3.20(A6)
A8: SK3.18(A8)
A9: SK3.17(A9)
A10: SK3.16(A10)
A11: SK3.15(A11)
A12: SK3.14(A12)
A13: SK3.13(A13)
A14: SK3.12(A14)
A15: SK3.11(A15)
A16: SK3.10(A16)
A17: SK3.8(A17)
A18: SK3.7(A18)
A19: SK3.6(A19)
A20: SK3.5(A20)
A21: SK3.4(A21)
A23: SK3.2(A23)
A24: SK3.1(A24)
A25: SK3.68(A25)
CLK3: SK3.67(CLK)
D0: RN311.6
D1: RN311.5
D2: RN311.8
D3: RN311.7
D4: RN312.5
D5: RN312.6
D6: RN312.8
D7: RN312.7
D8: RN314.5
D9: RN314.6
D10: RN314.8
D11: RN314.7
D12: RN313.5
D13: RN313.6
D14: RN313.8
D15: RN313.7
D16: RN321.5
D17: RN321.6
D18: RN321.8
D19: RN321.7
D20: RN322.5
D21: RN322.6
D22: RN322.8
D23: RN322.7
D24: RN324.6
D25: RN324.5
D26: RN324.7
D27: RN324.8
D28: RN323.6
D29: RN323.8
D30: RN323.7
D31: RN323.5
M3A7: SK3.19(A7)
M3A22: SK3.3(A22)
M3ABRT: SK3.53(ABRT)
M3DBE: IC301.1(1A) IC301.3(2A) SK3.56(DBE)
M3nCAS0: SK3.39(nCAS0) U31.31(LCAS)
M3nCAS1: SK3.40(nCAS1) U31.30(UCAS)
M3nCAS2: SK3.41(nCAS2) U32.31(LCAS)
M3nCAS3: SK3.42(nCAS3) U32.30(UCAS)
M3nRAS: SK3.38(nRAS) U31.14(RAS) U32.14(RAS)
M3OE: IC301.6(3Y) U31.29(OE) U32.29(OE)
M3RA0: SK3.28(RA0) U31.17(A0) U32.17(A0)
M3RA1: SK3.29(RA1) U31.18(A1) U32.18(A1)
M3RA2: SK3.30(RA2) U31.19(A2) U32.19(A2)
M3RA3: SK3.31(RA3) U31.20(A3) U32.20(A3)
M3RA4: SK3.32(RA4) U31.23(A4) U32.23(A4)
M3RA5: SK3.33(RA5) U31.24(A5) U32.24(A5)
M3RA6: SK3.34(RA6) U31.25(A6) U32.25(A6)
M3RA7: SK3.35(RA7) U31.26(A7) U32.26(A7)
M3RA8: SK3.36(RA8) U31.27(A8) U32.27(A8)
M3RA9: SK3.37(RA9) U31.28(A9) U32.28(A9)
M3WE: IC301.2(1Y) U31.13(WE) U32.13(WE)
MFLBK: SK3.45(FLBK)
MnBW: SK3.63(nBW)
MnSDRQ: SK3.47(nSDRQ)
MnVDRQ: SK3.48(nVDRQ)
MRST: SK3.44(RES)
nHSYC: SK3.46(nHSYC)
nIOGT: SK3.58(nIOGT)
nMREQ: SK3.55(nMREQ)
nRW: SK3.62(nRW)
REF3: SK3.64(RCLK)
SEQ: SK3.54(SEQ)
SPMD: SK3.52(SPMD)
NetIC301_4: IC301.4(2Y) IC301.5(3A)
NetRN311_1: RN311.1 U31.5(DQ3)
NetRN311_2: RN311.2 U31.4(DQ2)
NetRN311_3: RN311.3 U31.3(DQ1)
NetRN311_4: RN311.4 U31.2(DQ0)
NetRN312_1: RN312.1 U31.10(DQ7)
NetRN312_2: RN312.2 U31.9(DQ6)
NetRN312_3: RN312.3 U31.8(DQ5)
NetRN312_4: RN312.4 U31.7(DQ4)
NetRN313_1: RN313.1 U31.33(DQ8)
NetRN313_2: RN313.2 U31.34(DQ9)
NetRN313_3: RN313.3 U31.35(DQ10)
NetRN313_4: RN313.4 U31.36(DQ11)
NetRN314_1: RN314.1 U31.38(DQ12)
NetRN314_2: RN314.2 U31.39(DQ13)
NetRN314_3: RN314.3 U31.40(DQ14)
NetRN314_4: RN314.4 U31.41(DQ15)
NetRN321_1: RN321.1 U32.5(DQ3)
NetRN321_2: RN321.2 U32.4(DQ2)
NetRN321_3: RN321.3 U32.3(DQ1)
NetRN321_4: RN321.4 U32.2(DQ0)
NetRN322_1: RN322.1 U32.10(DQ7)
NetRN322_2: RN322.2 U32.9(DQ6)
NetRN322_3: RN322.3 U32.8(DQ5)
NetRN322_4: RN322.4 U32.7(DQ4)
NetRN323_1: RN323.1 U32.33(DQ8)
NetRN323_2: RN323.2 U32.34(DQ9)
NetRN323_3: RN323.3 U32.35(DQ10)
NetRN323_4: RN323.4 U32.36(DQ11)
NetRN324_1: RN324.1 U32.38(DQ12)
NetRN324_2: RN324.2 U32.39(DQ13)
NetRN324_3: RN324.3 U32.40(DQ14)
NetRN324_4: RN324.4 U32.41(DQ15)

Not connected (* = marked no-connect by the designer): IC301 8(4Y)* 10(5Y)* 12(6Y)*; SK3 49(nSDAK)* 50(nVDAK)* 51(nVIDW)* 57(nSIRQ)* 59(nIORQ)* 60(nRMCS)* 65(phi2)* 66(phi1)*; U31 15(A11)* 16(A10)*; U32 15(A11)* 16(A10)*

### Notes on the sheet
- SIZE
- CODION LTD
- DIMENSIONS
- TITLE
- VARIANT
- REVISION
- DATE
- A3
- SHEET
- OF
- FILE
- DRAWN BY

### Library data of the parts
C31-C38 = C2012X7R1H104K125AM: Capacitor; Manufacturer_Name: TDK; Datasheet Link: https://product.tdk.com/info/en/catalog/datasheets/mlcc_commercial_midvoltage_en.pdf; Height: 1.45mm; Manufacturer_Part_Number: C2012X7R1H104K125AM; Mouser Part Number: 810-C2012X7R1H104KT5; Mouser Price/Stock: https://www.mouser.com/Search/Refine.aspx?Keyword=810-C2012X7R1H104KT5; Arrow Part Number: C2012X7R1H104K125AM; Arrow Price/Stock: https://www.arrow.com/en/products/c2012x7r1h104k125am/tdk; LCSC Part #: C111492
IC301 = SN74AC04D: as IC52 on sheet A3000_16MB_Glue; Datasheet Link: http://www.ti.com/lit/ds/symlink/sn74ac04.pdf; Height: 1.75mm; Manufacturer_Part_Number: SN74AC04D; Mouser Part Number: 595-SN74AC04D; Mouser Price/Stock: https://www.mouser.co.uk/ProductDetail/Texas-Instruments/SN74AC04D?qs=w32V8uFkMxkvsyMHHacuZw%3D%3D; Arrow Part Number: SN74AC04D; Arrow Price/Stock: https://www.arrow.com/en/products/sn74ac04d/texas-instruments?region=nac; LCSC Part #: C352940
RN311-RN314 RN321-RN324 = YC164-JR-0768RL: as RN111 on sheet A3000_16MB; Datasheet Link: https://www.yageo.com/upload/media/product/productsearch/datasheet/rchip/PYu-YC_TC_group_51_RoHS_L_9.pdf; Height: 0.7mm; Manufacturer_Part_Number: YC164-JR-0768RL; Mouser Part Number: 603-YC164-JR-0768RL; Mouser Price/Stock: https://www.mouser.co.uk/ProductDetail/Yageo/YC164-JR-0768RL?qs=8cPjvKtxWv7AOp%2F0jDxI3w%3D%3D; Arrow Part Number: YC164-JR-0768RL; Arrow Price/Stock: https://www.arrow.com/en/products/yc164-jr-0768rl/yageo; LCSC Part #: C695188
SK3 = MEMC_Skt: as SK1 on sheet A3000_16MB; Datasheet Link: https://www.arrow.com/en/products/8468-21b1-rk-tr/3m; Height: 4.6mm; Mouser Part Number: 517-8468-21B1-RK-TR; Mouser Price/Stock: https://www.mouser.co.uk/ProductDetail/3M-Electronic-Solutions-Division/8468-21B1-RK-TR?qs=X%2F%2F06fXhnJ18zOj3KK47CQ%3D%3D; Arrow Part Number: 8468-21B1-RK-TR; Arrow Price/Stock: https://www.arrow.com/en/products/8468-21b1-rk-tr/3m
U31 U32 = DRAM_1MX16_SOJ: Value: IS41C16105C

## Sheet A3000_16MB_M4.SchDoc: ARM2 to ARM3 Adapter
size A3; DocumentNumber: 1; SheetNumber: 5; SheetTotal: 5
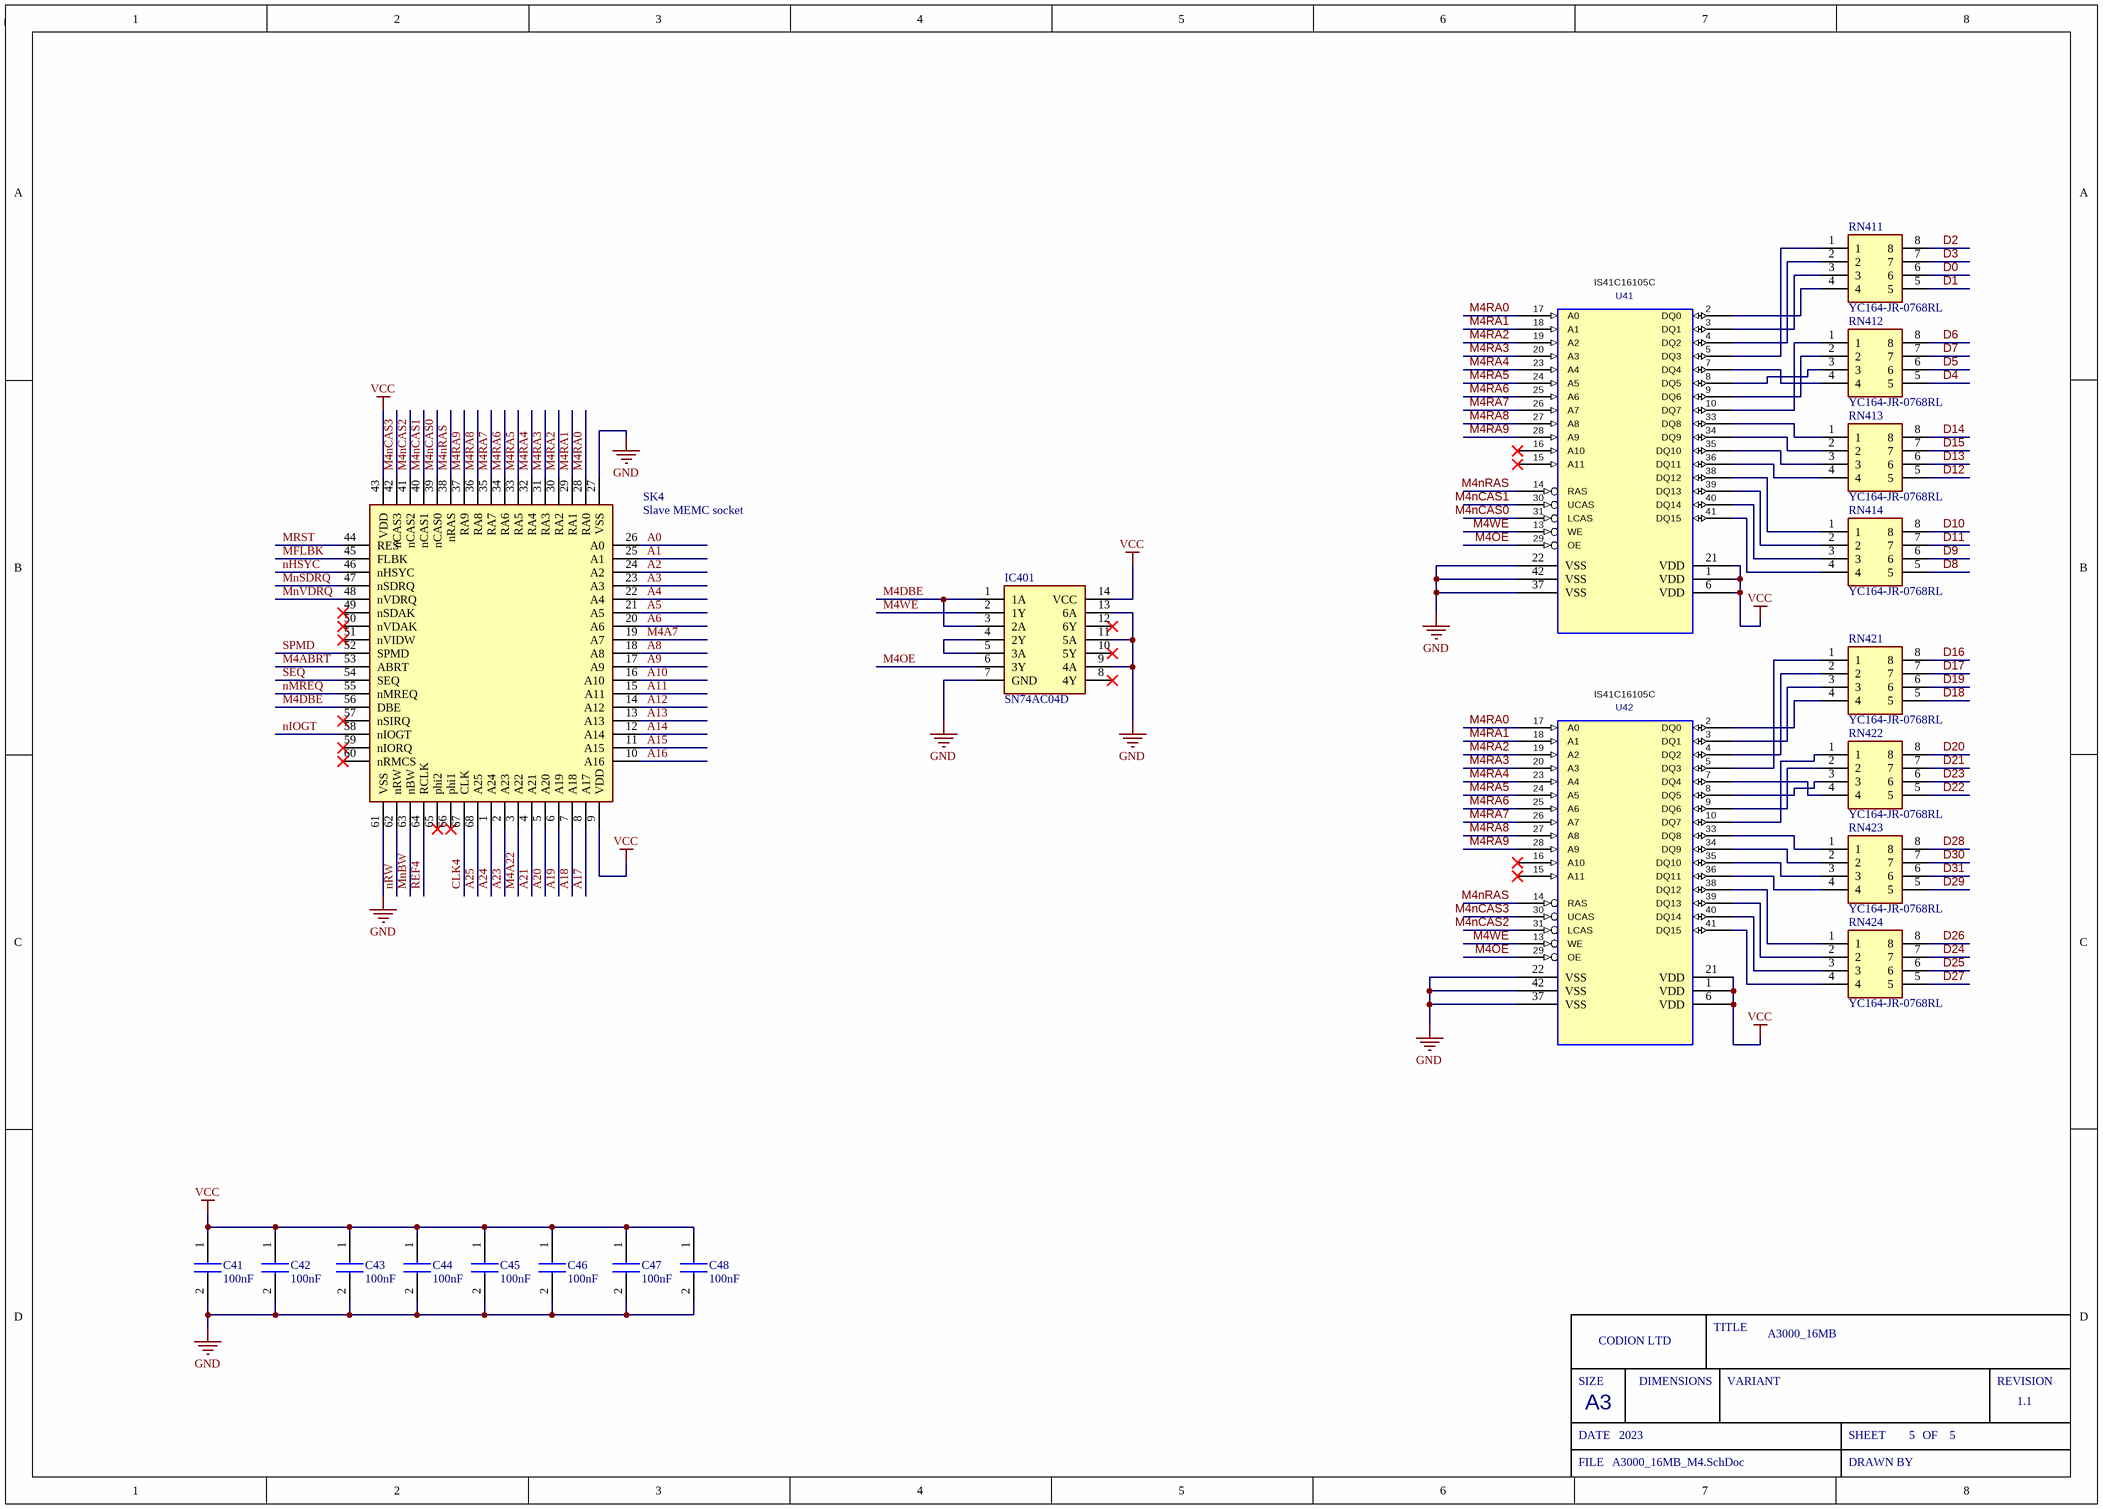
[diagram p4: A3000_16MB_M4.SchDoc]

### Parts
C41  100nF  [CAPC2012X145N]
C42  100nF  [CAPC2012X145N]
C43  100nF  [CAPC2012X145N]
C44  100nF  [CAPC2012X145N]
C45  100nF  [CAPC2012X145N]
C46  100nF  [CAPC2012X145N]
C47  100nF  [CAPC2012X145N]
C48  100nF  [CAPC2012X145N]
IC401  SN74AC04D  [SOIC127P600X175-14N]
RN411  YC164-JR-0768RL  [YC164JR0768RL]
RN412  YC164-JR-0768RL  [YC164JR0768RL]
RN413  YC164-JR-0768RL  [YC164JR0768RL]
RN414  YC164-JR-0768RL  [YC164JR0768RL]
RN421  YC164-JR-0768RL  [YC164JR0768RL]
RN422  YC164-JR-0768RL  [YC164JR0768RL]
RN423  YC164-JR-0768RL  [YC164JR0768RL]
RN424  YC164-JR-0768RL  [YC164JR0768RL]
SK4  Slave MEMC socket  [MEMC_Socket]
U41  IS41C16105C  [SOJ-42]
U42  IS41C16105C  [SOJ-42]

### Nets
GND: C41.2 C42.2 C43.2 C44.2 C45.2 C46.2 C47.2 C48.2 IC401.7(GND) IC401.9(4A) IC401.11(5A) IC401.13(6A) SK4.27(VSS) SK4.61(VSS) U41.22(VSS) U41.37(VSS) U41.42(VSS) U42.22(VSS) U42.37(VSS) U42.42(VSS)
VCC: C41.1 C42.1 C43.1 C44.1 C45.1 C46.1 C47.1 C48.1 IC401.14(VCC) SK4.9(VDD) SK4.43(VDD) U41.1(VCC) U41.6(VCC) U41.21(VCC) U42.1(VCC) U42.6(VCC) U42.21(VCC)
A0: SK4.26(A0)
A1: SK4.25(A1)
A2: SK4.24(A2)
A3: SK4.23(A3)
A4: SK4.22(A4)
A5: SK4.21(A5)
A6: SK4.20(A6)
A8: SK4.18(A8)
A9: SK4.17(A9)
A10: SK4.16(A10)
A11: SK4.15(A11)
A12: SK4.14(A12)
A13: SK4.13(A13)
A14: SK4.12(A14)
A15: SK4.11(A15)
A16: SK4.10(A16)
A17: SK4.8(A17)
A18: SK4.7(A18)
A19: SK4.6(A19)
A20: SK4.5(A20)
A21: SK4.4(A21)
A23: SK4.2(A23)
A24: SK4.1(A24)
A25: SK4.68(A25)
CLK4: SK4.67(CLK)
D0: RN411.6
D1: RN411.5
D2: RN411.8
D3: RN411.7
D4: RN412.5
D5: RN412.6
D6: RN412.8
D7: RN412.7
D8: RN414.5
D9: RN414.6
D10: RN414.8
D11: RN414.7
D12: RN413.5
D13: RN413.6
D14: RN413.8
D15: RN413.7
D16: RN421.8
D17: RN421.7
D18: RN421.5
D19: RN421.6
D20: RN422.8
D21: RN422.7
D22: RN422.5
D23: RN422.6
D24: RN424.7
D25: RN424.6
D26: RN424.8
D27: RN424.5
D28: RN423.8
D29: RN423.5
D30: RN423.7
D31: RN423.6
M4A7: SK4.19(A7)
M4A22: SK4.3(A22)
M4ABRT: SK4.53(ABRT)
M4DBE: IC401.1(1A) IC401.3(2A) SK4.56(DBE)
M4nCAS0: SK4.39(nCAS0) U41.31(LCAS)
M4nCAS1: SK4.40(nCAS1) U41.30(UCAS)
M4nCAS2: SK4.41(nCAS2) U42.31(LCAS)
M4nCAS3: SK4.42(nCAS3) U42.30(UCAS)
M4nRAS: SK4.38(nRAS) U41.14(RAS) U42.14(RAS)
M4OE: IC401.6(3Y) U41.29(OE) U42.29(OE)
M4RA0: SK4.28(RA0) U41.17(A0) U42.17(A0)
M4RA1: SK4.29(RA1) U41.18(A1) U42.18(A1)
M4RA2: SK4.30(RA2) U41.19(A2) U42.19(A2)
M4RA3: SK4.31(RA3) U41.20(A3) U42.20(A3)
M4RA4: SK4.32(RA4) U41.23(A4) U42.23(A4)
M4RA5: SK4.33(RA5) U41.24(A5) U42.24(A5)
M4RA6: SK4.34(RA6) U41.25(A6) U42.25(A6)
M4RA7: SK4.35(RA7) U41.26(A7) U42.26(A7)
M4RA8: SK4.36(RA8) U41.27(A8) U42.27(A8)
M4RA9: SK4.37(RA9) U41.28(A9) U42.28(A9)
M4WE: IC401.2(1Y) U41.13(WE) U42.13(WE)
MFLBK: SK4.45(FLBK)
MnBW: SK4.63(nBW)
MnSDRQ: SK4.47(nSDRQ)
MnVDRQ: SK4.48(nVDRQ)
MRST: SK4.44(RES)
nHSYC: SK4.46(nHSYC)
nIOGT: SK4.58(nIOGT)
nMREQ: SK4.55(nMREQ)
nRW: SK4.62(nRW)
REF4: SK4.64(RCLK)
SEQ: SK4.54(SEQ)
SPMD: SK4.52(SPMD)
NetIC401_4: IC401.4(2Y) IC401.5(3A)
NetRN411_1: RN411.1 U41.5(DQ3)
NetRN411_2: RN411.2 U41.4(DQ2)
NetRN411_3: RN411.3 U41.3(DQ1)
NetRN411_4: RN411.4 U41.2(DQ0)
NetRN412_1: RN412.1 U41.10(DQ7)
NetRN412_2: RN412.2 U41.9(DQ6)
NetRN412_3: RN412.3 U41.8(DQ5)
NetRN412_4: RN412.4 U41.7(DQ4)
NetRN413_1: RN413.1 U41.33(DQ8)
NetRN413_2: RN413.2 U41.34(DQ9)
NetRN413_3: RN413.3 U41.35(DQ10)
NetRN413_4: RN413.4 U41.36(DQ11)
NetRN414_1: RN414.1 U41.38(DQ12)
NetRN414_2: RN414.2 U41.39(DQ13)
NetRN414_3: RN414.3 U41.40(DQ14)
NetRN414_4: RN414.4 U41.41(DQ15)
NetRN421_1: RN421.1 U42.5(DQ3)
NetRN421_2: RN421.2 U42.4(DQ2)
NetRN421_3: RN421.3 U42.3(DQ1)
NetRN421_4: RN421.4 U42.2(DQ0)
NetRN422_1: RN422.1 U42.10(DQ7)
NetRN422_2: RN422.2 U42.9(DQ6)
NetRN422_3: RN422.3 U42.8(DQ5)
NetRN422_4: RN422.4 U42.7(DQ4)
NetRN423_1: RN423.1 U42.33(DQ8)
NetRN423_2: RN423.2 U42.34(DQ9)
NetRN423_3: RN423.3 U42.35(DQ10)
NetRN423_4: RN423.4 U42.36(DQ11)
NetRN424_1: RN424.1 U42.38(DQ12)
NetRN424_2: RN424.2 U42.39(DQ13)
NetRN424_3: RN424.3 U42.40(DQ14)
NetRN424_4: RN424.4 U42.41(DQ15)

Not connected (* = marked no-connect by the designer): IC401 8(4Y)* 10(5Y)* 12(6Y)*; SK4 49(nSDAK)* 50(nVDAK)* 51(nVIDW)* 57(nSIRQ)* 59(nIORQ)* 60(nRMCS)* 65(phi2)* 66(phi1)*; U41 15(A11)* 16(A10)*; U42 15(A11)* 16(A10)*

### Notes on the sheet
- SIZE
- CODION LTD
- DIMENSIONS
- TITLE
- VARIANT
- REVISION
- DATE
- A3
- SHEET
- OF
- FILE
- DRAWN BY

### Library data of the parts
C41-C48 = C2012X7R1H104K125AM: Capacitor; Manufacturer_Name: TDK; Datasheet Link: https://product.tdk.com/info/en/catalog/datasheets/mlcc_commercial_midvoltage_en.pdf; Height: 1.45mm; Manufacturer_Part_Number: C2012X7R1H104K125AM; Mouser Part Number: 810-C2012X7R1H104KT5; Mouser Price/Stock: https://www.mouser.com/Search/Refine.aspx?Keyword=810-C2012X7R1H104KT5; Arrow Part Number: C2012X7R1H104K125AM; Arrow Price/Stock: https://www.arrow.com/en/products/c2012x7r1h104k125am/tdk; LCSC Part #: C111492
IC401 = SN74AC04D: as IC52 on sheet A3000_16MB_Glue; Datasheet Link: http://www.ti.com/lit/ds/symlink/sn74ac04.pdf; Height: 1.75mm; Manufacturer_Part_Number: SN74AC04D; Mouser Part Number: 595-SN74AC04D; Mouser Price/Stock: https://www.mouser.co.uk/ProductDetail/Texas-Instruments/SN74AC04D?qs=w32V8uFkMxkvsyMHHacuZw%3D%3D; Arrow Part Number: SN74AC04D; Arrow Price/Stock: https://www.arrow.com/en/products/sn74ac04d/texas-instruments?region=nac; LCSC Part #: C352940
RN411-RN414 RN421-RN424 = YC164-JR-0768RL: as RN111 on sheet A3000_16MB; Datasheet Link: https://www.yageo.com/upload/media/product/productsearch/datasheet/rchip/PYu-YC_TC_group_51_RoHS_L_9.pdf; Height: 0.7mm; Manufacturer_Part_Number: YC164-JR-0768RL; Mouser Part Number: 603-YC164-JR-0768RL; Mouser Price/Stock: https://www.mouser.co.uk/ProductDetail/Yageo/YC164-JR-0768RL?qs=8cPjvKtxWv7AOp%2F0jDxI3w%3D%3D; Arrow Part Number: YC164-JR-0768RL; Arrow Price/Stock: https://www.arrow.com/en/products/yc164-jr-0768rl/yageo; LCSC Part #: C695188
SK4 = MEMC_Skt: as SK1 on sheet A3000_16MB; Datasheet Link: https://www.arrow.com/en/products/8468-21b1-rk-tr/3m; Height: 4.6mm; Mouser Part Number: 517-8468-21B1-RK-TR; Mouser Price/Stock: https://www.mouser.co.uk/ProductDetail/3M-Electronic-Solutions-Division/8468-21B1-RK-TR?qs=X%2F%2F06fXhnJ18zOj3KK47CQ%3D%3D; Arrow Part Number: 8468-21B1-RK-TR; Arrow Price/Stock: https://www.arrow.com/en/products/8468-21b1-rk-tr/3m
U41 U42 = DRAM_1MX16_SOJ: Value: IS41C16105C